# Altium project miaow-foc-board.prjpcb (part 1 of 2)
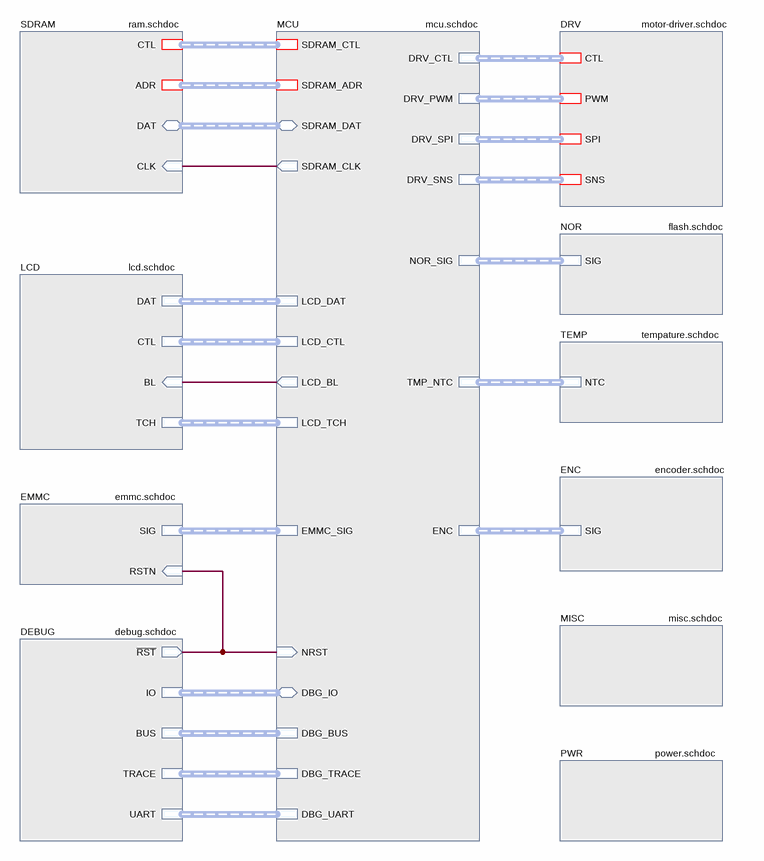
[diagram p0: top.schdoc]
Board: MIAOW FOC BOARD; Url: github.com/miaow-cn/foc-hw; Sample: A1; Liscense: GPLv3
14 sheets, 437 parts. Net scope: hierarchical (ports join the sheet entries above them; power ports are global).
Board file: miaow-foc-board.pcbdoc
Sheets:
  top.schdoc
    DRV = motor-driver.schdoc
    SDRAM = ram.schdoc
    PWR = power.schdoc
    MCU = mcu.schdoc
      MCU_PWR = mcu-power.schdoc
      MCU_SIG = mcu-io.schdoc
    LCD = lcd.schdoc
    EMMC = emmc.schdoc
    NOR = flash.schdoc
    DEBUG = debug.schdoc
    TEMP = tempature.schdoc
    MISC = misc.schdoc
    ENC = encoder.schdoc

## Sheet top.schdoc: TOP
size A4; Date: 10.25.2025; CheckedBy: BCY; DrawnBy: miaow; DocumentNumber: 1; Revision: v1.0.0; SheetNumber: 1; SheetTotal: 14; BoardType: MAIN_PCB; Desc: Top block diagram

### Sub-sheets
DEBUG = debug.schdoc: BUS (harness DBG_BUS), ~{RST} (out), TRACE (harness DBG_TRACE), UART (harness DBG_UART), IO (harness DBG_IO)
DRV = motor-driver.schdoc: CTL (harness DRV_CTL), SNS (harness DRV_SNS), SPI (harness DRV_SPI), PWM (harness DRV_PWM)
EMMC = emmc.schdoc: SIG (harness EMMC_SIG), RSTN (in)
ENC = encoder.schdoc: SIG (harness ENC_SIG)
LCD = lcd.schdoc: DAT (harness LCD_DAT), CTL (harness LCD_CTL), BL (in), TCH (harness LCD_TCH)
MCU = mcu.schdoc: SDRAM_CLK (out), SDRAM_CTL (harness SDRAM_CTL), SDRAM_ADR (harness SDRAM_ADR), SDRAM_DAT (bidir, harness SDRAM_DAT), DRV_CTL (harness DRV_CTL), DRV_PWM (harness DRV_PWM), DRV_SPI (harness DRV_SPI), DRV_SNS (harness DRV_SNS), NRST (in), LCD_DAT (harness LCD_DAT), LCD_BL (out), LCD_TCH (harness LCD_TCH), EMMC_SIG (harness EMMC_SIG), NOR_SIG (harness NOR_SIG), LCD_CTL (harness LCD_CTL), DBG_TRACE (harness DBG_TRACE), DBG_UART (harness DBG_UART), DBG_BUS (harness DBG_BUS), DBG_IO (bidir, harness DBG_IO), TMP_NTC (harness TMP_NTC), ENC (harness ENC_SIG)
MISC = misc.schdoc: no entries
NOR = flash.schdoc: SIG (harness NOR_SIG)
PWR = power.schdoc: no entries
SDRAM = ram.schdoc: ADR (harness SDRAM_ADR), CTL (harness SDRAM_CTL), CLK (in), DAT (bidir, harness SDRAM_DAT)
TEMP = tempature.schdoc: NTC (harness TMP_NTC)

### Nets
BL: sheet MCU/LCD_BL, sheet LCD/BL
NRST: sheet MCU/NRST, sheet EMMC/RSTN, sheet DEBUG/~{RST}
SDRAM_CLK: sheet SDRAM/CLK, sheet MCU/SDRAM_CLK

### Buses and harness runs
harness sheet DEBUG/BUS = sheet MCU/DBG_BUS
harness sheet DEBUG/IO = sheet MCU/DBG_IO
harness sheet DEBUG/TRACE = sheet MCU/DBG_TRACE
harness sheet DEBUG/UART = sheet MCU/DBG_UART
harness sheet DRV/CTL = sheet MCU/DRV_CTL
harness sheet DRV/PWM = sheet MCU/DRV_PWM
harness sheet DRV/SNS = sheet MCU/DRV_SNS
harness sheet DRV/SPI = sheet MCU/DRV_SPI
harness sheet EMMC/SIG = sheet MCU/EMMC_SIG
harness sheet ENC/SIG = sheet MCU/ENC
harness sheet LCD/CTL = sheet MCU/LCD_CTL
harness sheet LCD/DAT = sheet MCU/LCD_DAT
harness sheet LCD/TCH = sheet MCU/LCD_TCH
harness sheet MCU/NOR_SIG = sheet NOR/SIG
harness sheet MCU/SDRAM_ADR = sheet SDRAM/ADR
harness sheet MCU/SDRAM_CTL = sheet SDRAM/CTL
harness sheet MCU/SDRAM_DAT = sheet SDRAM/DAT
harness sheet MCU/TMP_NTC = sheet TEMP/NTC

### Notes on the sheet
- DRAWN
- CHECKED
- DRAWNBY
- SHEETS
- SHEETS_NO

## Sheet motor-driver.schdoc: DRV
size A4; Date: 10.25.2025; CheckedBy: BCY; DrawnBy: miaow; DocumentNumber: 9; Revision: v1.0.0; SheetNumber: 9; SheetTotal: 14; BoardType: MAIN_PCB; Desc: PMSM & BLDC driver
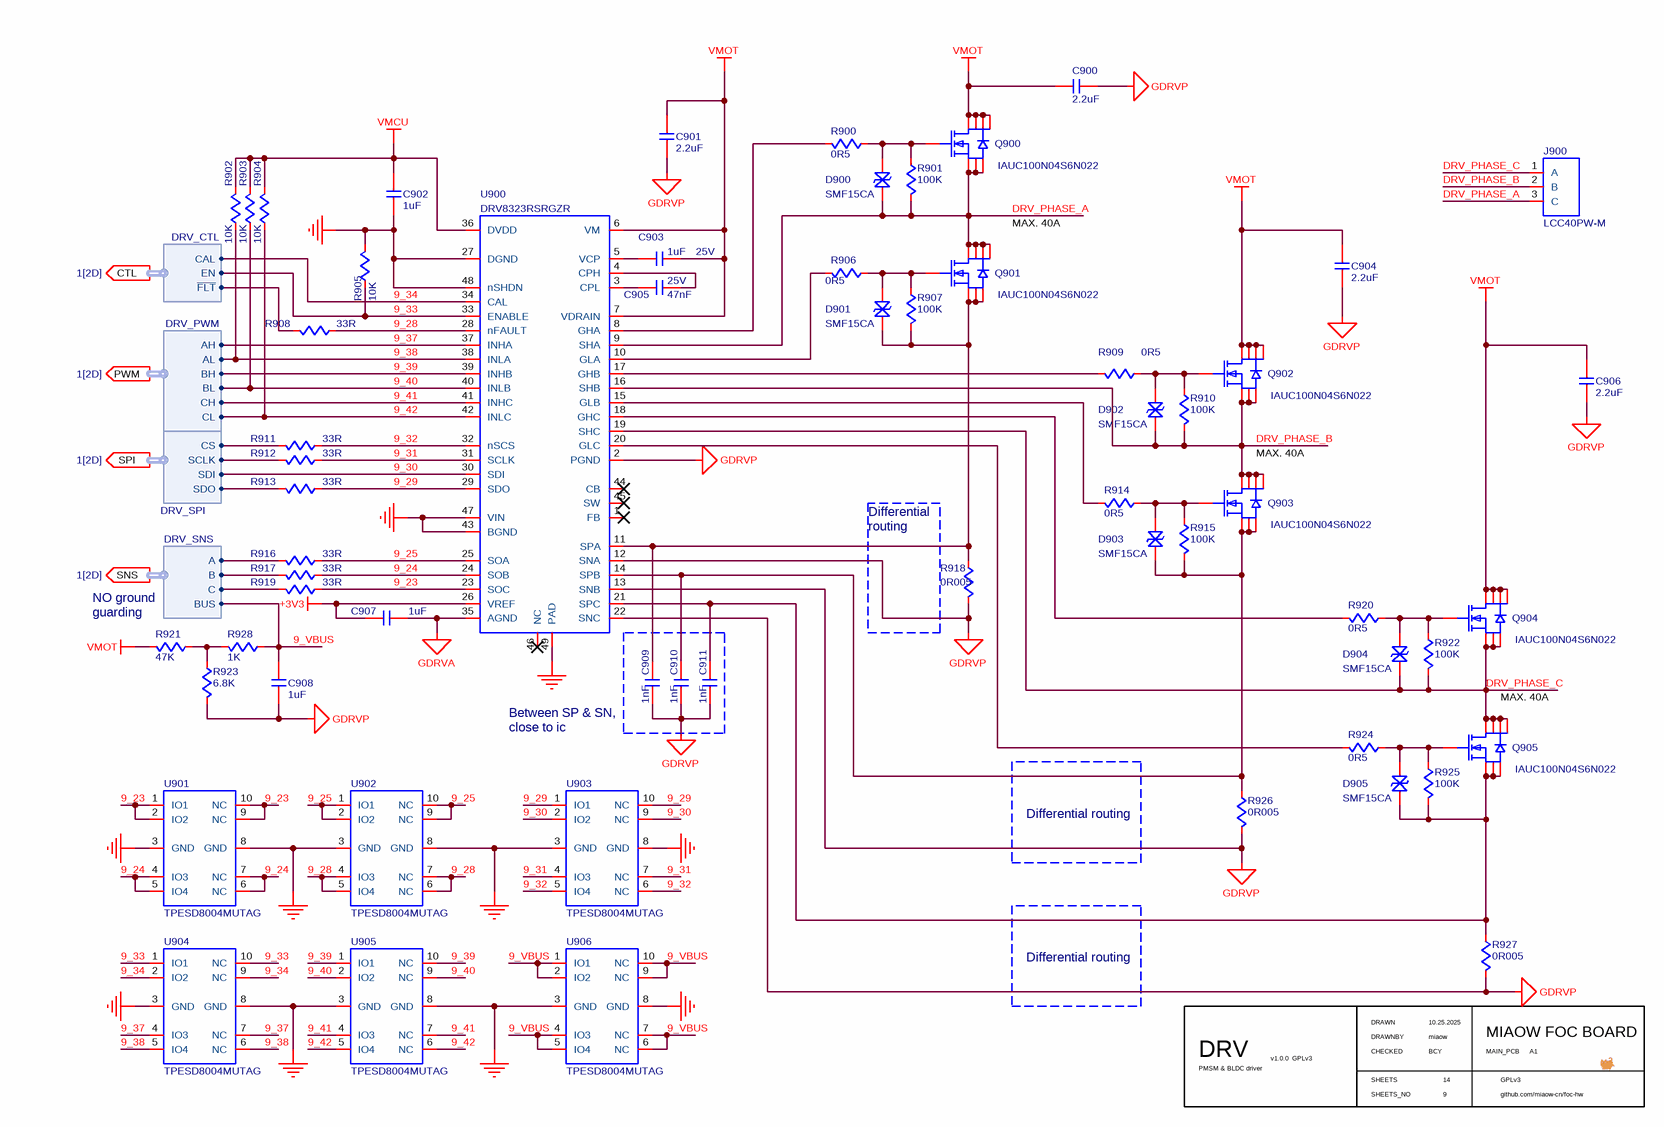
[diagram p1: motor-driver.schdoc]

### Parts
C900  value 2.2uF  [C0603]  (hidden comment: C-NOMO)
C901  value 2.2uF  [C0603]  (hidden comment: C-NOMO)
C902  value 1uF  [C0402]  (hidden comment: C-NOMO)
C903  value 1uF  voltage: 25V  [C0402]  (hidden comment: C-NOMO)
C904  value 2.2uF  [C0603]  (hidden comment: C-NOMO)
C905  value 47nF  voltage: 25V  [C0402]  (hidden comment: C-NOMO)
C906  value 2.2uF  [C0603]  (hidden comment: C-NOMO)
C907  value 1uF  [C0402]  (hidden comment: C-NOMO)
C908  value 1uF  [C0603]  (hidden comment: C-NOMO)
C909  value 1nF  [C0402]  (hidden comment: C-NOMO)
C910  value 1nF  [C0402]  (hidden comment: C-NOMO)
C911  value 1nF  [C0402]  (hidden comment: C-NOMO)
D900  SMF15CA  [SMF15CA]
D901  SMF15CA  [SMF15CA]
D902  SMF15CA  [SMF15CA]
D903  SMF15CA  [SMF15CA]
D904  SMF15CA  [SMF15CA]
D905  SMF15CA  [SMF15CA]
J900  LCC40PW-M  [LCC40PW-M]
Q900  IAUC100N04S6N022  [IAUC100N04S6N022]
Q901  IAUC100N04S6N022  [IAUC100N04S6N022]
Q902  IAUC100N04S6N022  [IAUC100N04S6N022]
Q903  IAUC100N04S6N022  [IAUC100N04S6N022]
Q904  IAUC100N04S6N022  [IAUC100N04S6N022]
Q905  IAUC100N04S6N022  [IAUC100N04S6N022]
R900  value 0R5  [R0402]  (hidden comment: R)
R901  value 100K  [R0603]  (hidden comment: R)
R902  value 10K  [R0402]  (hidden comment: R)
R903  value 10K  [R0402]  (hidden comment: R)
R904  value 10K  [R0402]  (hidden comment: R)
R905  value 10K  [R0402]  (hidden comment: R)
R906  value 0R5  [R0402]  (hidden comment: R)
R907  value 100K  [R0603]  (hidden comment: R)
R908  value 33R  [R0402]  (hidden comment: R)
R909  value 0R5  [R0402]  (hidden comment: R)
R910  value 100K  [R0603]  (hidden comment: R)
R911  value 33R  [R0402]  (hidden comment: R)
R912  value 33R  [R0402]  (hidden comment: R)
R913  value 33R  [R0402]  (hidden comment: R)
R914  value 0R5  [R0402]  (hidden comment: R)
R915  value 100K  [R0603]  (hidden comment: R)
R916  value 33R  [R0402]  (hidden comment: R)
R917  value 33R  [R0402]  (hidden comment: R)
R918  value 0R005  [R2512]  (hidden comment: R)
R919  value 33R  [R0402]  (hidden comment: R)
R920  value 0R5  [R0402]  (hidden comment: R)
R921  value 47K  [R0603]  (hidden comment: R)
R922  value 100K  [R0603]  (hidden comment: R)
R923  value 6.8K  [R0603]  (hidden comment: R)
R924  value 0R5  [R0402]  (hidden comment: R)
R925  value 100K  [R0603]  (hidden comment: R)
R926  value 0R005  [R2512]  (hidden comment: R)
R927  value 0R005  [R2512]  (hidden comment: R)
R928  value 1K  [R0603]  (hidden comment: R)
U900  DRV8323RSRGZR  [DRV8323RSRGZR]
U901  TPESD8004MUTAG  [TPESD8004MUTAG]
U902  TPESD8004MUTAG  [TPESD8004MUTAG]
U903  TPESD8004MUTAG  [TPESD8004MUTAG]
U904  TPESD8004MUTAG  [TPESD8004MUTAG]
U905  TPESD8004MUTAG  [TPESD8004MUTAG]
U906  TPESD8004MUTAG  [TPESD8004MUTAG]

### Ports
CTL (out, harness DRV_CTL, see 1[2D]), PWM (out, harness DRV_PWM, see 1[2D]), SNS (out, harness DRV_SNS, see 1[2D]), SPI (out, harness DRV_SPI, see 1[2D])

### Harnesses
DRV_CTL: CAL, EN, ~{FLT}
DRV_SNS: C, B, A, BUS
DRV_SPI: CS, SCLK, SDI, SDO
DRV_PWM: AH, AL, BH, BL, CH, CL

### Nets
+3V3: C902.2 C907.1 R902.1 R903.1 R904.1 U900.26(VREF) U900.36(DVDD)  [also labelled VMCU]
GDRVA: C902.1 C907.2 R905.1 U900.27(DGND) U900.35(AGND) U900.43(BGND) U900.47(VIN) U900.48(nSHDN) U900.49(PAD) U901.3(GND) U901.8(GND) U902.3(GND) U902.8(GND) U903.3(GND) U903.8(GND) U904.3(GND) U904.8(GND) U905.3(GND) U905.8(GND) U906.3(GND) U906.8(GND)  [also labelled GND]
GDRVP: C900.1 C901.1 C904.1 C906.1 C908.2 C909.1 C910.1 C911.1 R918.1 R923.1 R926.1 R927.1 U900.2(PGND) U900.12(SNA) U900.13(SNB) U900.22(SNC)
VMOT: C900.2 C901.2 C903.2 C904.2 C906.2 Q900.5(D) Q900.6(D) Q900.7(D) Q900.8(D) Q902.5(D) Q902.6(D) Q902.7(D) Q902.8(D) Q904.5(D) Q904.6(D) Q904.7(D) Q904.8(D) R921.1 U900.6(VM) U900.7(VDRAIN)
9_23: R919.2 U900.23(SOC) U901.1(IO1) U901.2(IO2) U901.9(NC) U901.10(NC)
9_24: R917.2 U900.24(SOB) U901.4(IO3) U901.5(IO4) U901.6(NC) U901.7(NC)
9_25: R916.2 U900.25(SOA) U902.1(IO1) U902.2(IO2) U902.9(NC) U902.10(NC)
9_28: R908.2 U900.28(nFAULT) U902.4(IO3) U902.5(IO4) U902.6(NC) U902.7(NC)
9_29: R913.2 U900.29(SDO) U903.1(IO1) U903.10(NC)
9_30: U900.30(SDI) U903.2(IO2) U903.9(NC) ; port SPI.SDI
9_31: R912.2 U900.31(SCLK) U903.4(IO3) U903.7(NC)
9_32: R911.2 U900.32(nSCS) U903.5(IO4) U903.6(NC)
9_33: R905.2 U900.33(ENABLE) U904.1(IO1) U904.10(NC) ; port CTL.EN
9_34: U900.34(CAL) U904.2(IO2) U904.9(NC) ; port CTL.CAL
9_37: U900.37(INHA) U904.4(IO3) U904.7(NC) ; port PWM.AH
9_38: R902.2 U900.38(INLA) U904.5(IO4) U904.6(NC) ; port PWM.AL
9_39: U900.39(INHB) U905.1(IO1) U905.10(NC) ; port PWM.BH
9_40: R903.2 U900.40(INLB) U905.2(IO2) U905.9(NC) ; port PWM.BL
9_41: U900.41(INHC) U905.4(IO3) U905.7(NC) ; port PWM.CH
9_42: R904.2 U900.42(INLC) U905.5(IO4) U905.6(NC) ; port PWM.CL
9_VBUS: C908.1 R928.2 U906.1(IO1) U906.2(IO2) U906.4(IO3) U906.5(IO4) U906.6(NC) U906.7(NC) U906.9(NC) U906.10(NC) ; port SNS.BUS
DRV_CS: R911.1 ; port SPI.CS
DRV_FLT: R908.1 ; port CTL.~{FLT}
DRV_PHASE_A: D900.1 J900.3(C) Q900.1(S) Q900.2(S) Q900.3(S) Q901.5(D) Q901.6(D) Q901.7(D) Q901.8(D) R901.1 U900.9(SHA)
DRV_PHASE_B: D902.1 J900.2(B) Q902.1(S) Q902.2(S) Q902.3(S) Q903.5(D) Q903.6(D) Q903.7(D) Q903.8(D) R910.1 U900.16(SHB)
DRV_PHASE_C: D904.1 J900.1(A) Q904.1(S) Q904.2(S) Q904.3(S) Q905.5(D) Q905.6(D) Q905.7(D) Q905.8(D) R922.1 U900.19(SHC)
DRV_SCLK: R912.1 ; port SPI.SCLK
DRV_SDO: R913.1 ; port SPI.SDO
DRV_SNS_A: R916.1 ; port SNS.A
DRV_SNS_B: R917.1 ; port SNS.B
DRV_SNS_C: R919.1 ; port SNS.C
NetC903_1: C903.1 U900.5(VCP)
NetC905_1: C905.1 U900.3(CPL)
NetC905_2: C905.2 U900.4(CPH)
NetC909_2: C909.2 D901.1 Q901.1(S) Q901.2(S) Q901.3(S) R907.1 R918.2 U900.11(SPA)
NetC910_2: C910.2 D903.1 Q903.1(S) Q903.2(S) Q903.3(S) R915.1 R926.2 U900.14(SPB)
NetC911_2: C911.2 D905.1 Q905.1(S) Q905.2(S) Q905.3(S) R925.1 R927.2 U900.21(SPC)
NetD900_2: D900.2 Q900.4(G) R900.2 R901.2
NetD901_2: D901.2 Q901.4(G) R906.2 R907.2
NetD902_2: D902.2 Q902.4(G) R909.2 R910.2
NetD903_2: D903.2 Q903.4(G) R914.2 R915.2
NetD904_2: D904.2 Q904.4(G) R920.2 R922.2
NetD905_2: D905.2 Q905.4(G) R924.2 R925.2
NetR900_1: R900.1 U900.8(GHA)
NetR906_1: R906.1 U900.10(GLA)
NetR909_1: R909.1 U900.17(GHB)
NetR914_1: R914.1 U900.15(GLB)
NetR920_1: R920.1 U900.18(GHC)
NetR921_2: R921.2 R923.2 R928.1
NetR924_1: R924.1 U900.20(GLC)

Not connected (* = marked no-connect by the designer): U900 1(FB)* 44(CB)* 45(SW)* 46(NC)*

### Notes on the sheet
- (near Q901) MAX. 40A
- (near Q903) MAX. 40A
- (near R918) Differential routing
- (near R921) NO ground guarding
- (near Q905) MAX. 40A
- (near C909) Between SP & SN, close to ic
- Differential routing
- DRAWN
- CHECKED
- DRAWNBY
- SHEETS
- SHEETS_NO

### Library data of the parts
C900-C902 C904 C906-C911 = C-NOMO: voltage: 25V; precision: 5%
C903 C905 = C-NOMO: precision: 5%
D900-D905 = SMF15CA: TVS/ESD; Supplier 1: LCSC; Supplier Part Number 1: C123803
J900 = LCC40PW-M: CONNECTOR - 3pin, power; Supplier 1: LCSC; Supplier Part Number 1: C7437310
R900-R928 = R: precision: 1%
U901-U906 = TPESD8004MUTAG: TVS/ESD; Supplier 1: LCSC; Supplier Part Number 1: C2827679
Q900-Q905 = IAUC100N04S6N022: Supplier 1: LCSC; Supplier Part Number 1: C535695
U900 = DRV8323RSRGZR: Supplier 1: LCSC; Supplier Part Number 1: C545497

## Sheet ram.schdoc: RAM
size A4; Date: 10.25.2025; CheckedBy: BCY; DrawnBy: miaow; DocumentNumber: 3; Revision: v1.0.0; SheetNumber: 3; SheetTotal: 14; BoardType: MAIN_PCB; Desc: SDRAM for mcu
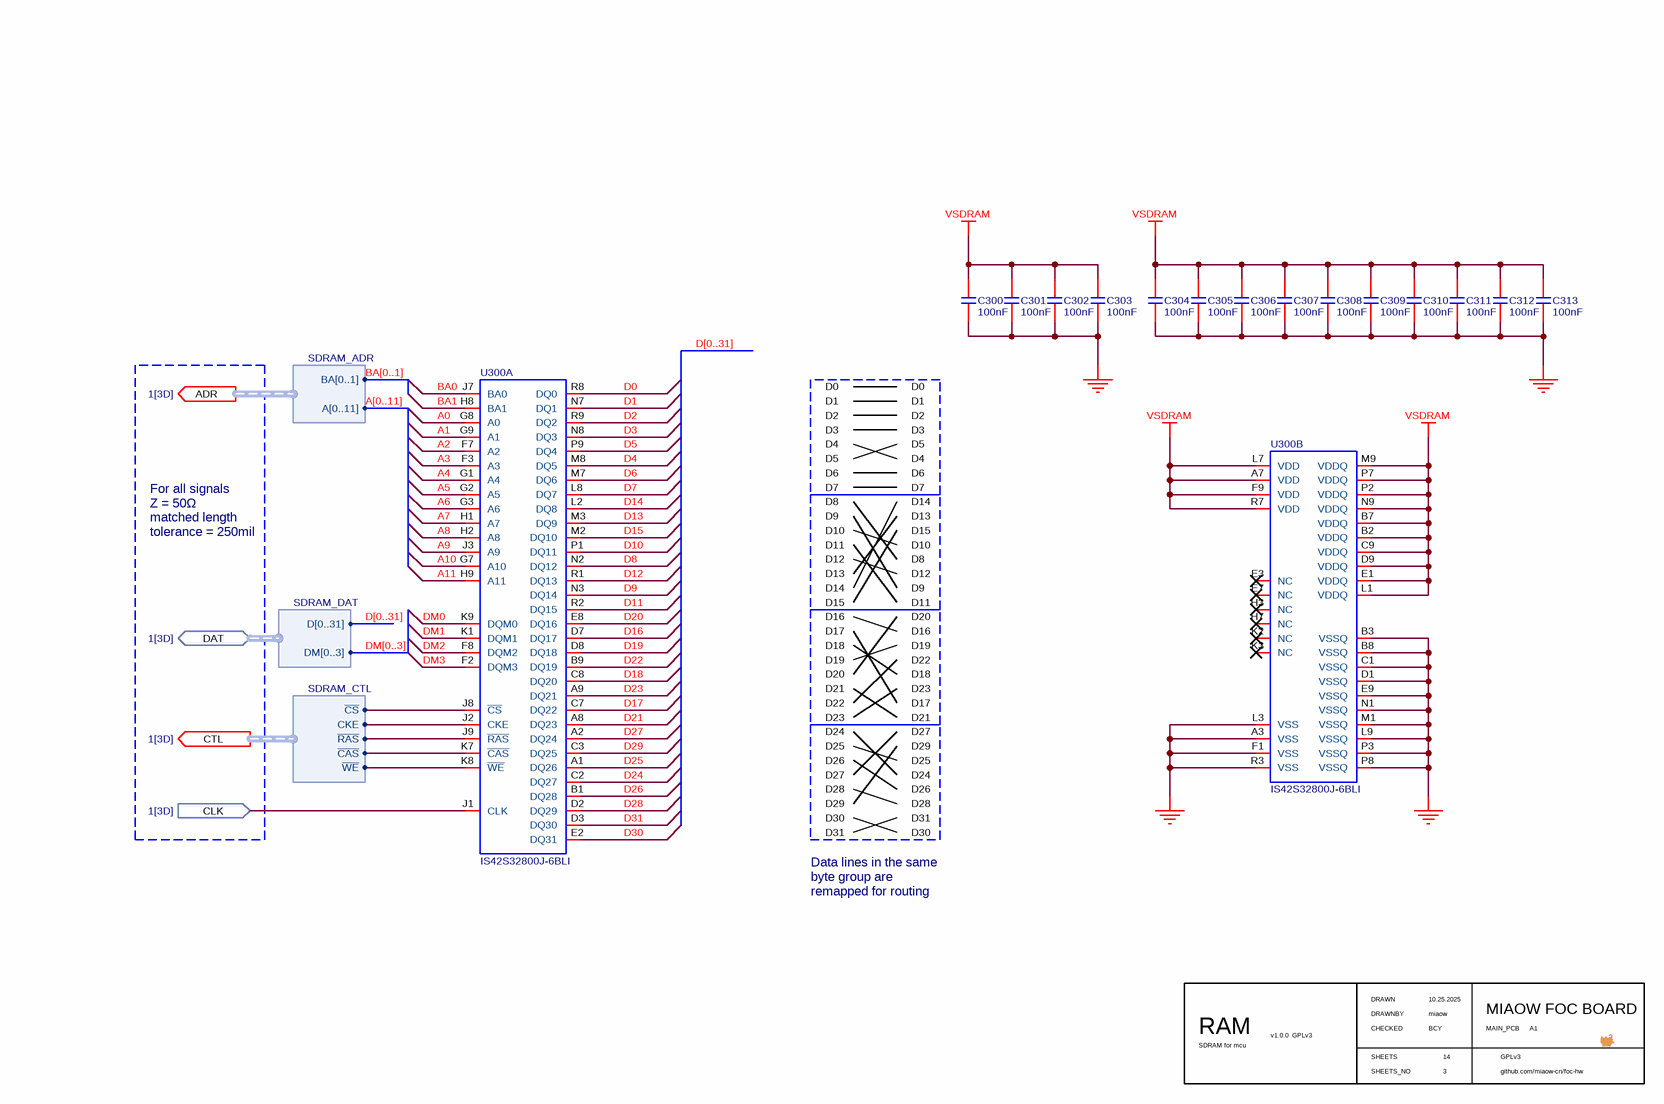
[diagram p2: ram.schdoc]

### Parts
C300  value 100nF  [C0402]  (hidden comment: C-NOMO)
C301  value 100nF  [C0402]  (hidden comment: C-NOMO)
C302  value 100nF  [C0402]  (hidden comment: C-NOMO)
C303  value 100nF  [C0402]  (hidden comment: C-NOMO)
C304  value 100nF  [C0402]  (hidden comment: C-NOMO)
C305  value 100nF  [C0402]  (hidden comment: C-NOMO)
C306  value 100nF  [C0402]  (hidden comment: C-NOMO)
C307  value 100nF  [C0402]  (hidden comment: C-NOMO)
C308  value 100nF  [C0402]  (hidden comment: C-NOMO)
C309  value 100nF  [C0402]  (hidden comment: C-NOMO)
C310  value 100nF  [C0402]  (hidden comment: C-NOMO)
C311  value 100nF  [C0402]  (hidden comment: C-NOMO)
C312  value 100nF  [C0402]  (hidden comment: C-NOMO)
C313  value 100nF  [C0402]  (hidden comment: C-NOMO)
U300  IS42S32800J-6BLI  [IS42S32800J-6BLI]  (parts A,B of 2)

### Ports
ADR (out, harness SDRAM_ADR, see 1[3D]), CLK (in, see 1[3D]), CTL (out, harness SDRAM_CTL, see 1[3D]), DAT (bidir, harness SDRAM_DAT, see 1[3D])

### Harnesses
SDRAM_CTL: ~{CS}, CKE, ~{RAS}, ~{CAS}, ~{WE}
SDRAM_ADR: BA[0..1], A[0..11]
SDRAM_DAT: DM[0..3], D[0..31]

### Nets
GND: C300.1 C301.1 C302.1 C303.1 C304.1 C305.1 C306.1 C307.1 C308.1 C309.1 C310.1 C311.1 C312.1 C313.1 U300.A3(VSS) U300.B3(VSSQ) U300.B8(VSSQ) U300.C1(VSSQ) U300.D1(VSSQ) U300.E9(VSSQ) U300.F1(VSS) U300.L3(VSS) U300.L9(VSSQ) U300.M1(VSSQ) U300.N1(VSSQ) U300.P3(VSSQ) U300.P8(VSSQ) U300.R3(VSS)  [project net GDRVA]
VSDRAM: C300.2 C301.2 C302.2 C303.2 C304.2 C305.2 C306.2 C307.2 C308.2 C309.2 C310.2 C311.2 C312.2 C313.2 U300.A7(VDD) U300.B2(VDDQ) U300.B7(VDDQ) U300.C9(VDDQ) U300.D9(VDDQ) U300.E1(VDDQ) U300.F9(VDD) U300.L1(VDDQ) U300.L7(VDD) U300.M9(VDDQ) U300.N9(VDDQ) U300.P2(VDDQ) U300.P7(VDDQ) U300.R7(VDD)  [project net +3V3]
A0: U300.G8(A0)
A1: U300.G9(A1)
A2: U300.F7(A2)
A3: U300.F3(A3)
A4: U300.G1(A4)
A5: U300.G2(A5)
A6: U300.G3(A6)
A7: U300.H1(A7)
A8: U300.H2(A8)
A9: U300.J3(A9)
A10: U300.G7(A10)
A11: U300.H9(A11)
BA0: U300.J7(BA0)
BA1: U300.H8(BA1)
D0: U300.R8(DQ0)
D1: U300.N7(DQ1)
D2: U300.R9(DQ2)
D3: U300.N8(DQ3)
D4: U300.M8(DQ5)
D5: U300.P9(DQ4)
D6: U300.M7(DQ6)
D7: U300.L8(DQ7)
D8: U300.N2(DQ12)
D9: U300.N3(DQ14)
D10: U300.P1(DQ11)
D11: U300.R2(DQ15)
D12: U300.R1(DQ13)
D13: U300.M3(DQ9)
D14: U300.L2(DQ8)
D15: U300.M2(DQ10)
D16: U300.D7(DQ17)
D17: U300.C7(DQ22)
D18: U300.C8(DQ20)
D19: U300.D8(DQ18)
D20: U300.E8(DQ16)
D21: U300.A8(DQ23)
D22: U300.B9(DQ19)
D23: U300.A9(DQ21)
D24: U300.C2(DQ27)
D25: U300.A1(DQ26)
D26: U300.B1(DQ28)
D27: U300.A2(DQ24)
D28: U300.D2(DQ29)
D29: U300.C3(DQ25)
D30: U300.E2(DQ31)
D31: U300.D3(DQ30)
DM0: U300.K9(DQM0)
DM1: U300.K1(DQM1)
DM2: U300.F8(DQM2)
DM3: U300.F2(DQM3)
SDRAM_CAS: U300.K7(~{CAS}) ; port CTL.~{CAS}
SDRAM_CKE: U300.J2(CKE) ; port CTL.CKE
SDRAM_CLK: U300.J1(CLK) ; port CLK
SDRAM_CS: U300.J8(~{CS}) ; port CTL.~{CS}
SDRAM_RAS: U300.J9(~{RAS}) ; port CTL.~{RAS}
SDRAM_WE: U300.K8(~{WE}) ; port CTL.~{WE}

Not connected (* = marked no-connect by the designer): U300 E3(NC)* E7(NC)* H3(NC)* H7(NC)* K2(NC)* K3(NC)*

### Buses and harness runs
bus A[0..11]
bus BA[0..1]
bus D[0..31]
bus DM[0..3]

### Notes on the sheet
- D0
- D1
- D2
- D3
- D4
- D5
- D6
- D7
- D8
- D9
- D10
- D11
- D14
- D15
- D13
- For all signals
  Z = 50Ω
  matched length tolerance = 250mil
- D12
- D16
- D20
- D17
- D18
- D19
- D21
- D23
- D22
- D24
- D25
- D26
- D27
- D29
- D28
- D30
- D31
- Data lines in the same byte group are remapped for routing
- DRAWN
- CHECKED
- DRAWNBY
- SHEETS
- SHEETS_NO

### Library data of the parts
C300-C313 = C-NOMO: voltage: 25V; precision: 5%
U300 = IS42S32800J-6BLI: Supplier 1: LCSC; Supplier Part Number 1: C1351419

## Sheet power.schdoc: PWR
size A4; Date: 10.25.2025; CheckedBy: BCY; DrawnBy: miaow; DocumentNumber: 2; Revision: v1.0.0; SheetNumber: 2; SheetTotal: 14; BoardType: MAIN_PCB; Desc: Power filter and rails
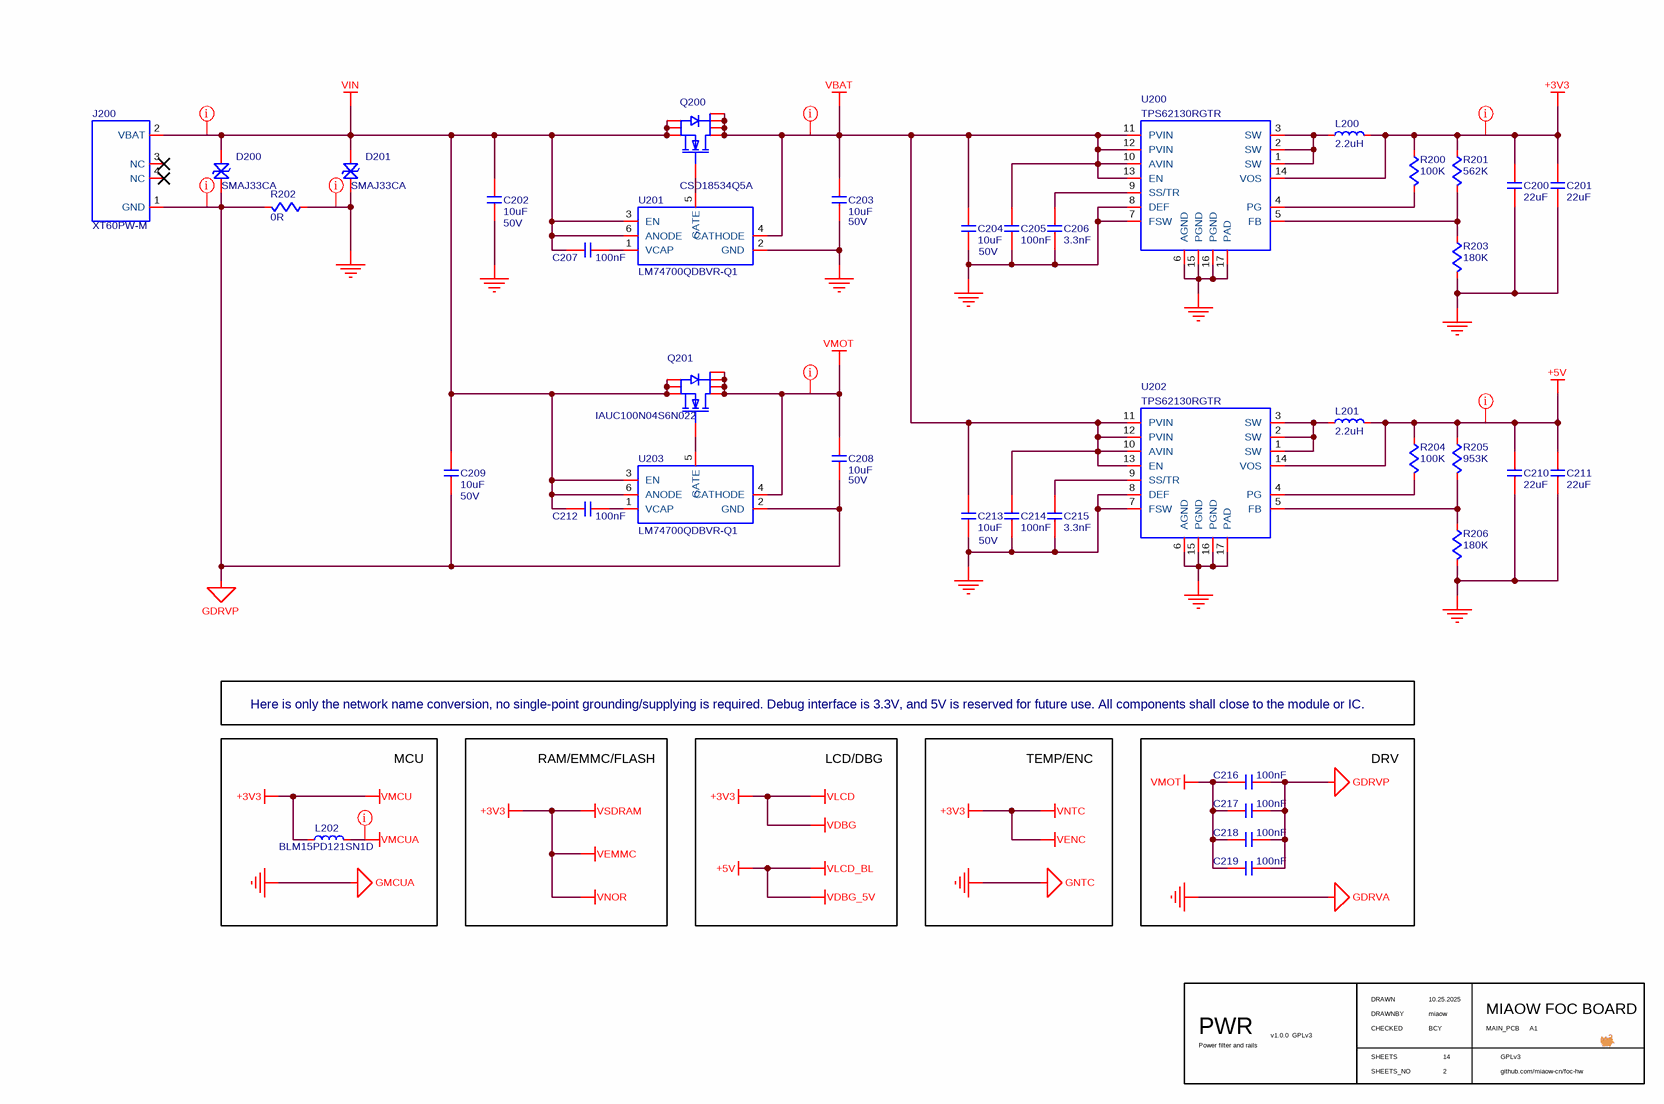
[diagram p3: power.schdoc]

### Parts
C200  value 22uF  [C0805]  (hidden comment: C-NOMO)
C201  value 22uF  [C0805]  (hidden comment: C-NOMO)
C202  value 10uF  voltage: 50V  [C0805]  (hidden comment: C-NOMO)
C203  value 10uF  voltage: 50V  [C0805]  (hidden comment: C-NOMO)
C204  value 10uF  voltage: 50V  [C0805]  (hidden comment: C-NOMO)
C205  value 100nF  [C0603]  (hidden comment: C-NOMO)
C206  value 3.3nF  [C0402]  (hidden comment: C-NOMO)
C207  value 100nF  [C0402]  (hidden comment: C-NOMO)
C208  value 10uF  voltage: 50V  [C0805]  (hidden comment: C-NOMO)
C209  value 10uF  voltage: 50V  [C0805]  (hidden comment: C-NOMO)
C210  value 22uF  [C0805]  (hidden comment: C-NOMO)
C211  value 22uF  [C0805]  (hidden comment: C-NOMO)
C212  value 100nF  [C0402]  (hidden comment: C-NOMO)
C213  value 10uF  voltage: 50V  [C0805]  (hidden comment: C-NOMO)
C214  value 100nF  [C0603]  (hidden comment: C-NOMO)
C215  value 3.3nF  [C0402]  (hidden comment: C-NOMO)
C216  value 100nF  [C0603]  (hidden comment: C-NOMO)
C217  value 100nF  [C0603]  (hidden comment: C-NOMO)
C218  value 100nF  [C0603]  (hidden comment: C-NOMO)
C219  value 100nF  [C0603]  (hidden comment: C-NOMO)
D200  SMAJ33CA  [SMAJ33CA]
D201  SMAJ33CA  [SMAJ33CA]
J200  XT60PW-M  [XT60PW-M]
L200  value 2.2uH  [FXL0420]  (hidden comment: L)
L201  value 2.2uH  [FXL0420]  (hidden comment: L)
L202  BLM15PD121SN1D  [L0402]
Q200  CSD18534Q5A  [CSD18534Q5A]
Q201  IAUC100N04S6N022  [IAUC100N04S6N022]
R200  value 100K  [R0402]  (hidden comment: R)
R201  value 562K  [R0603]  (hidden comment: R)
R202  value 0R  [R1206]  (hidden comment: R)
R203  value 180K  [R0603]  (hidden comment: R)
R204  value 100K  [R0402]  (hidden comment: R)
R205  value 953K  [R0603]  (hidden comment: R)
R206  value 180K  [R0603]  (hidden comment: R)
U200  TPS62130RGTR  [TPS62130RGTR]
U201  LM74700QDBVR-Q1  [LM74700QDBVR-Q1]
U202  TPS62130RGTR  [TPS62130RGTR]
U203  LM74700QDBVR-Q1  [LM74700QDBVR-Q1]

### Blocks framed on the sheet
MCU: L202
DRV: C216-C219

### Nets
+3V3: C200.2 C201.2 L200.2 L202.1 R200.2 R201.2 U200.14(VOS)  [also labelled VDBG, VEMMC, VENC, VLCD, VMCU, VNOR, VNTC, VSDRAM]
+5V: C210.2 C211.2 L201.2 R204.2 R205.2 U202.14(VOS)  [also labelled VDBG_5V, VLCD_BL]
GDRVA: C200.1 C201.1 C202.1 C203.1 C204.1 C205.1 C206.1 C210.1 C211.1 C213.1 C214.1 C215.1 D201.1 R202.2 R203.1 R206.1 U200.6(AGND) U200.7(FSW) U200.8(DEF) U200.15(PGND) U200.16(PGND) U200.17(PAD) U201.2(GND) U202.6(AGND) U202.7(FSW) U202.8(DEF) U202.15(PGND) U202.16(PGND) U202.17(PAD)  [also labelled GMCUA, GND, GNTC]
GDRVP: C208.1 C209.1 C216.1 C217.1 C218.1 C219.1 D200.1 J200.1(GND) R202.1 U203.2(GND)
VBAT: C203.2 C204.2 C205.2 C213.2 C214.2 Q200.5(D) Q200.6(D) Q200.7(D) Q200.8(D) U200.10(AVIN) U200.11(PVIN) U200.12(PVIN) U200.13(EN) U201.4(CATHODE) U202.10(AVIN) U202.11(PVIN) U202.12(PVIN) U202.13(EN)
VIN: C202.2 C207.1 C209.2 C212.1 D200.2 D201.2 J200.2(VBAT) Q200.1(S) Q200.2(S) Q200.3(S) Q201.1(S) Q201.2(S) Q201.3(S) U201.3(EN) U201.6(ANODE) U203.3(EN) U203.6(ANODE)
VMCUA: L202.2
VMOT: C208.2 C216.2 C217.2 C218.2 C219.2 Q201.5(D) Q201.6(D) Q201.7(D) Q201.8(D) U203.4(CATHODE)
NetC206_2: C206.2 U200.9(SS/TR)
NetC207_2: C207.2 U201.1(VCAP)
NetC212_2: C212.2 U203.1(VCAP)
NetC215_2: C215.2 U202.9(SS/TR)
NetL200_1: L200.1 U200.1(SW) U200.2(SW) U200.3(SW)
NetL201_1: L201.1 U202.1(SW) U202.2(SW) U202.3(SW)
NetQ200_4: Q200.4(G) U201.5(GATE)
NetQ201_4: Q201.4(G) U203.5(GATE)
NetR200_1: R200.1 U200.4(PG)
NetR201_1: R201.1 R203.2 U200.5(FB)
NetR204_1: R204.1 U202.4(PG)
NetR205_1: R205.1 R206.2 U202.5(FB)

Not connected (* = marked no-connect by the designer): J200 3(NC)* 4(NC)*

### Layout directives
net class CLS_PWR; rule Supply Nets [Voltage = 12.00]: VIN
net class CLS_PWR: +3V3, +5V, VBAT, VMCUA, VMOT
net class CLS_GND: GDRVA, GDRVP

### Notes on the sheet
- Here is only the network name conversion, no single-point grounding/supplying is required. Debug interface is 3.3V, and 5V is reserved for future use. All components shall close to the module or IC.
- RAM/EMMC/FLASH
- LCD/DBG
- TEMP/ENC
- DRAWN
- CHECKED
- DRAWNBY
- SHEETS
- SHEETS_NO

### Library data of the parts
C200 C201 C205-C207 C210-C212 C214-C219 = C-NOMO: voltage: 25V; precision: 5%
C202-C204 C208 C209 C213 = C-NOMO: precision: 5%
D200 D201 = SMAJ33CA: TVS/ESD; Supplier 1: LCSC; Supplier Part Number 1: C316048
J200 = XT60PW-M: CONNECTOR - dc supply; Supplier 1: LCSC; Supplier Part Number 1: C98732
L200 L201 = L: Code_IEC: 1005; Published: 8-Jun-2000; LatestRevisionDate: 29-May-2009; LatestRevisionNote: IPC-7351 Footprint Added.; PackageReference: 0402-A; Publisher: Altium Limited; PackageDescription: Chip Inductor; Code_JEITA: 0402
L202 = L: Code_IEC: 1005; Value: 120R@100MHz; Published: 8-Jun-2000; LatestRevisionDate: 29-May-2009; LatestRevisionNote: IPC-7351 Footprint Added.; PackageReference: 0402-A; Publisher: Altium Limited; PackageDescription: Chip Inductor; Code_JEITA: 0402
Q200 = CSD18534Q5A: NMOS; Supplier 1: LCSC; Supplier Part Number 1: C115943
Q201 = IAUC100N04S6N022: NMOS; Supplier 1: LCSC; Supplier Part Number 1: C535695
R200-R206 = R: precision: 1%
U201 U203 = LM74700QDBVR-Q1: IDEAL DIODE; Supplier Part Number 1: C2941042; Supplier 1: LCSC
U200 U202 = TPS62130RGTR: Supplier 1: LCSC; Supplier Part Number 1: C43590

## Sheet mcu.schdoc: MCU
size A4; Date: 10.25.2025; CheckedBy: BCY; DrawnBy: miaow; DocumentNumber: 11; Revision: v1.0.0; SheetNumber: 11; SheetTotal: 14; BoardType: MAIN_PCB; Desc: MCB block diagram
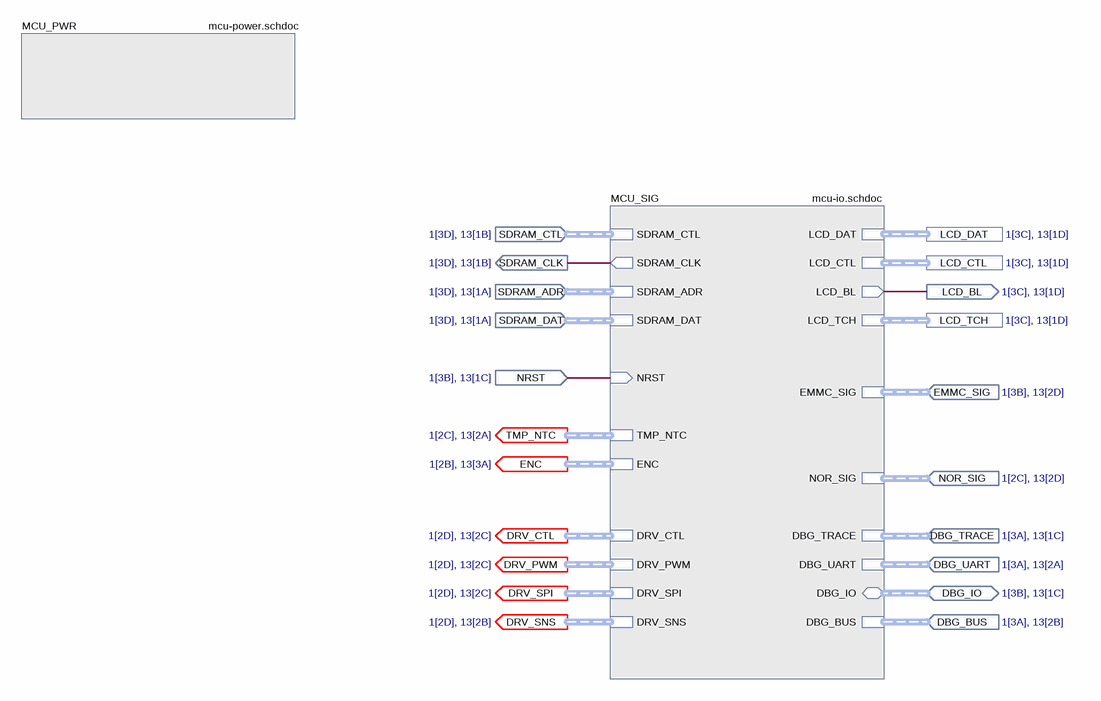
[diagram p4: mcu.schdoc]

### Sub-sheets
MCU_PWR = mcu-power.schdoc: no entries
MCU_SIG = mcu-io.schdoc: SDRAM_CTL (harness SDRAM_CTL), SDRAM_CLK (out), SDRAM_DAT (harness SDRAM_DAT), SDRAM_ADR (harness SDRAM_ADR), NRST (in), DRV_CTL (harness DRV_CTL), DRV_PWM (harness DRV_PWM), DRV_SPI (harness DRV_SPI), DRV_SNS (harness DRV_SNS), LCD_DAT (harness LCD_DAT), LCD_CTL (harness LCD_CTL), LCD_BL (out), LCD_TCH (harness LCD_TCH), EMMC_SIG (harness EMMC_SIG), NOR_SIG (harness NOR_SIG), DBG_TRACE (harness DBG_TRACE), DBG_UART (harness DBG_UART), DBG_IO (bidir, harness DBG_IO), DBG_BUS (harness DBG_BUS), TMP_NTC (harness TMP_NTC), ENC (harness ENC_SIG)

### Ports
DBG_BUS (in, harness DBG_BUS, see 1[3A], 13[2B]), DBG_IO (bidir, harness DBG_IO, see 1[3B], 13[1C]), DBG_TRACE (in, harness DBG_TRACE, see 1[3A], 13[1C]), DBG_UART (in, harness DBG_UART, see 1[3A], 13[2A]), DRV_CTL (out, harness DRV_CTL, see 1[2D], 13[2C]), DRV_PWM (out, harness DRV_PWM, see 1[2D], 13[2C]), DRV_SNS (out, harness DRV_SNS, see 1[2D], 13[2B]), DRV_SPI (out, harness DRV_SPI, see 1[2D], 13[2C]), EMMC_SIG (in, harness EMMC_SIG, see 1[3B], 13[2D]), ENC (out, harness ENC_SIG, see 1[2B], 13[3A]), LCD_BL (out, see 1[3C], 13[1D]), LCD_CTL (harness LCD_CTL, see 1[3C], 13[1D]), LCD_DAT (harness LCD_DAT, see 1[3C], 13[1D]), LCD_TCH (harness LCD_TCH, see 1[3C], 13[1D]), NOR_SIG (in, harness NOR_SIG, see 1[2C], 13[2D]), NRST (in, see 1[3B], 13[1C]), SDRAM_ADR (in, harness SDRAM_ADR, see 1[3D], 13[1A]), SDRAM_CLK (out, see 1[3D], 13[1B]), SDRAM_CTL (in, harness SDRAM_CTL, see 1[3D], 13[1B]), SDRAM_DAT (in, harness SDRAM_DAT, see 1[3D], 13[1A]), TMP_NTC (out, harness TMP_NTC, see 1[2C], 13[2A])

### Nets
BL: port LCD_BL, sheet MCU_SIG/LCD_BL
NRST: port NRST, sheet MCU_SIG/NRST
SDRAM_CLK: port SDRAM_CLK, sheet MCU_SIG/SDRAM_CLK

### Buses and harness runs
harness port DBG_BUS = sheet MCU_SIG/DBG_BUS
harness port DBG_IO = sheet MCU_SIG/DBG_IO
harness port DBG_TRACE = sheet MCU_SIG/DBG_TRACE
harness port DBG_UART = sheet MCU_SIG/DBG_UART
harness port DRV_CTL = sheet MCU_SIG/DRV_CTL
harness port DRV_PWM = sheet MCU_SIG/DRV_PWM
harness port DRV_SNS = sheet MCU_SIG/DRV_SNS
harness port DRV_SPI = sheet MCU_SIG/DRV_SPI
harness port EMMC_SIG = sheet MCU_SIG/EMMC_SIG
harness port ENC = sheet MCU_SIG/ENC
harness port LCD_CTL = sheet MCU_SIG/LCD_CTL
harness port LCD_DAT = sheet MCU_SIG/LCD_DAT
harness port LCD_TCH = sheet MCU_SIG/LCD_TCH
harness port NOR_SIG = sheet MCU_SIG/NOR_SIG
harness port SDRAM_ADR = sheet MCU_SIG/SDRAM_ADR
harness port SDRAM_CTL = sheet MCU_SIG/SDRAM_CTL
harness port SDRAM_DAT = sheet MCU_SIG/SDRAM_DAT
harness port TMP_NTC = sheet MCU_SIG/TMP_NTC

### Notes on the sheet
- DRAWN
- CHECKED
- DRAWNBY
- SHEETS
- SHEETS_NO

## Sheet mcu-power.schdoc: MCUA
size A4; Date: 10.25.2025; CheckedBy: BCY; DrawnBy: miaow; DocumentNumber: 12; Revision: v1.0.0; SheetNumber: 12; SheetTotal: 14; BoardType: MAIN_PCB; Desc: Power subpart of  MCU
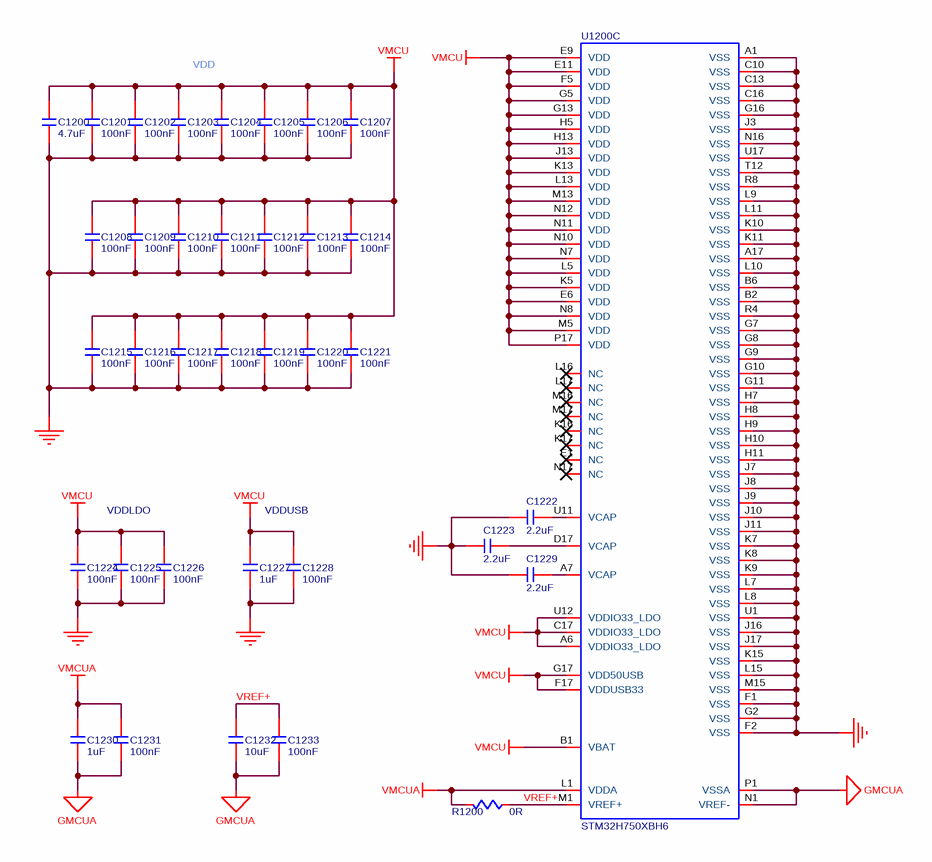
[diagram p5: mcu-power.schdoc]

### Parts
C1200  value 4.7uF  [C0603]  (hidden comment: C-NOMO)
C1201  value 100nF  [C0402]  (hidden comment: C-NOMO)
C1202  value 100nF  [C0402]  (hidden comment: C-NOMO)
C1203  value 100nF  [C0402]  (hidden comment: C-NOMO)
C1204  value 100nF  [C0402]  (hidden comment: C-NOMO)
C1205  value 100nF  [C0402]  (hidden comment: C-NOMO)
C1206  value 100nF  [C0402]  (hidden comment: C-NOMO)
C1207  value 100nF  [C0402]  (hidden comment: C-NOMO)
C1208  value 100nF  [C0402]  (hidden comment: C-NOMO)
C1209  value 100nF  [C0402]  (hidden comment: C-NOMO)
C1210  value 100nF  [C0402]  (hidden comment: C-NOMO)
C1211  value 100nF  [C0402]  (hidden comment: C-NOMO)
C1212  value 100nF  [C0402]  (hidden comment: C-NOMO)
C1213  value 100nF  [C0402]  (hidden comment: C-NOMO)
C1214  value 100nF  [C0402]  (hidden comment: C-NOMO)
C1215  value 100nF  [C0402]  (hidden comment: C-NOMO)
C1216  value 100nF  [C0402]  (hidden comment: C-NOMO)
C1217  value 100nF  [C0402]  (hidden comment: C-NOMO)
C1218  value 100nF  [C0402]  (hidden comment: C-NOMO)
C1219  value 100nF  [C0402]  (hidden comment: C-NOMO)
C1220  value 100nF  [C0402]  (hidden comment: C-NOMO)
C1221  value 100nF  [C0402]  (hidden comment: C-NOMO)
C1222  value 2.2uF  [C0402]  (hidden comment: C-NOMO)
C1223  value 2.2uF  [C0402]  (hidden comment: C-NOMO)
C1224  value 100nF  [C0402]  (hidden comment: C-NOMO)
C1225  value 100nF  [C0402]  (hidden comment: C-NOMO)
C1226  value 100nF  [C0402]  (hidden comment: C-NOMO)
C1227  value 1uF  [C0603]  (hidden comment: C-NOMO)
C1228  value 100nF  [C0402]  (hidden comment: C-NOMO)
C1229  value 2.2uF  [C0402]  (hidden comment: C-NOMO)
C1230  value 1uF  [C0603]  (hidden comment: C-NOMO)
C1231  value 100nF  [C0402]  (hidden comment: C-NOMO)
C1232  value 10uF  [C0805]  (hidden comment: C-NOMO)
C1233  value 100nF  [C0402]  (hidden comment: C-NOMO)
R1200  value 0R  [R0603]  (hidden comment: R)
U1200  STM32H750XBH6  [STM32H750XBH6]  (part C of 3)

### Nets
GMCUA: C1200.1 C1201.1 C1202.1 C1203.1 C1204.1 C1205.1 C1206.1 C1207.1 C1208.1 C1209.1 C1210.1 C1211.1 C1212.1 C1213.1 C1214.1 C1215.1 C1216.1 C1217.1 C1218.1 C1219.1 C1220.1 C1221.1 C1222.1 C1223.1 C1224.1 C1225.1 C1226.1 C1227.1 C1228.1 C1229.1 C1230.1 C1231.1 C1232.1 C1233.1 U1200.A1(VSS) U1200.A17(VSS) U1200.B2(VSS) U1200.B6(VSS) U1200.C10(VSS) U1200.C13(VSS) U1200.C16(VSS) U1200.F1(VSS) U1200.F2(VSS) U1200.G2(VSS) U1200.G7(VSS) U1200.G8(VSS) U1200.G9(VSS) U1200.G10(VSS) U1200.G11(VSS) U1200.G16(VSS) U1200.H7(VSS) U1200.H8(VSS) U1200.H9(VSS) U1200.H10(VSS) U1200.H11(VSS) U1200.J3(VSS) U1200.J7(VSS) U1200.J8(VSS) U1200.J9(VSS) U1200.J10(VSS) U1200.J11(VSS) U1200.J16(VSS) U1200.J17(VSS) U1200.K7(VSS) U1200.K8(VSS) U1200.K9(VSS) U1200.K10(VSS) U1200.K11(VSS) U1200.K15(VSS) U1200.L7(VSS) U1200.L8(VSS) U1200.L9(VSS) U1200.L10(VSS) U1200.L11(VSS) U1200.L15(VSS) U1200.M15(VSS) U1200.N1(VREF-) U1200.N16(VSS) U1200.P1(VSSA) U1200.R4(VSS) U1200.R8(VSS) U1200.T12(VSS) U1200.U1(VSS) U1200.U17(VSS)  [also labelled GND]  [project net GDRVA]
VMCU: C1200.2 C1201.2 C1202.2 C1203.2 C1204.2 C1205.2 C1206.2 C1207.2 C1208.2 C1209.2 C1210.2 C1211.2 C1212.2 C1213.2 C1214.2 C1215.2 C1216.2 C1217.2 C1218.2 C1219.2 C1220.2 C1221.2 C1224.2 C1225.2 C1226.2 C1227.2 C1228.2 U1200.A6(VDDIO33_LDO) U1200.B1(VBAT) U1200.C17(VDDIO33_LDO) U1200.E6(VDD) U1200.E9(VDD) U1200.E11(VDD) U1200.F5(VDD) U1200.F17(VDDUSB33) U1200.G5(VDD) U1200.G13(VDD) U1200.G17(VDD50USB) U1200.H5(VDD) U1200.H13(VDD) U1200.J13(VDD) U1200.K5(VDD) U1200.K13(VDD) U1200.L5(VDD) U1200.L13(VDD) U1200.M5(VDD) U1200.M13(VDD) U1200.N7(VDD) U1200.N8(VDD) U1200.N10(VDD) U1200.N11(VDD) U1200.N12(VDD) U1200.P17(VDD) U1200.U12(VDDIO33_LDO)  [project net +3V3]
VMCUA: C1230.2 C1231.2 R1200.1 U1200.L1(VDDA)
VREF+: C1232.2 C1233.2 R1200.2 U1200.M1(VREF+)
NetC1222_2: C1222.2 U1200.U11(VCAP)
NetC1223_2: C1223.2 U1200.D17(VCAP)
NetC1229_2: C1229.2 U1200.A7(VCAP)

Not connected (* = marked no-connect by the designer): U1200 E1(NC)* K16(NC)* K17(NC)* L16(NC)* L17(NC)* M16(NC)* M17(NC)* N17(NC)*

### Notes on the sheet
- VDD
- VDDLDO
- VDDUSB
- DRAWN
- CHECKED
- DRAWNBY
- SHEETS
- SHEETS_NO

### Library data of the parts
C1200-C1233 = C-NOMO: voltage: 25V; precision: 5%
R1200 = R: precision: 1%
U1200 = STM32H750XBH6: MCU; Supplier 1: LCSC; Supplier Part Number 1: C405932

## Sheet mcu-io.schdoc: MCUB
size A4; Date: 10.25.2025; CheckedBy: BCY; DrawnBy: miaow; DocumentNumber: 13; Revision: v1.1.0; SheetNumber: 13; SheetTotal: 14; BoardType: MAIN_PCB; Desc: IO sub part of MCU
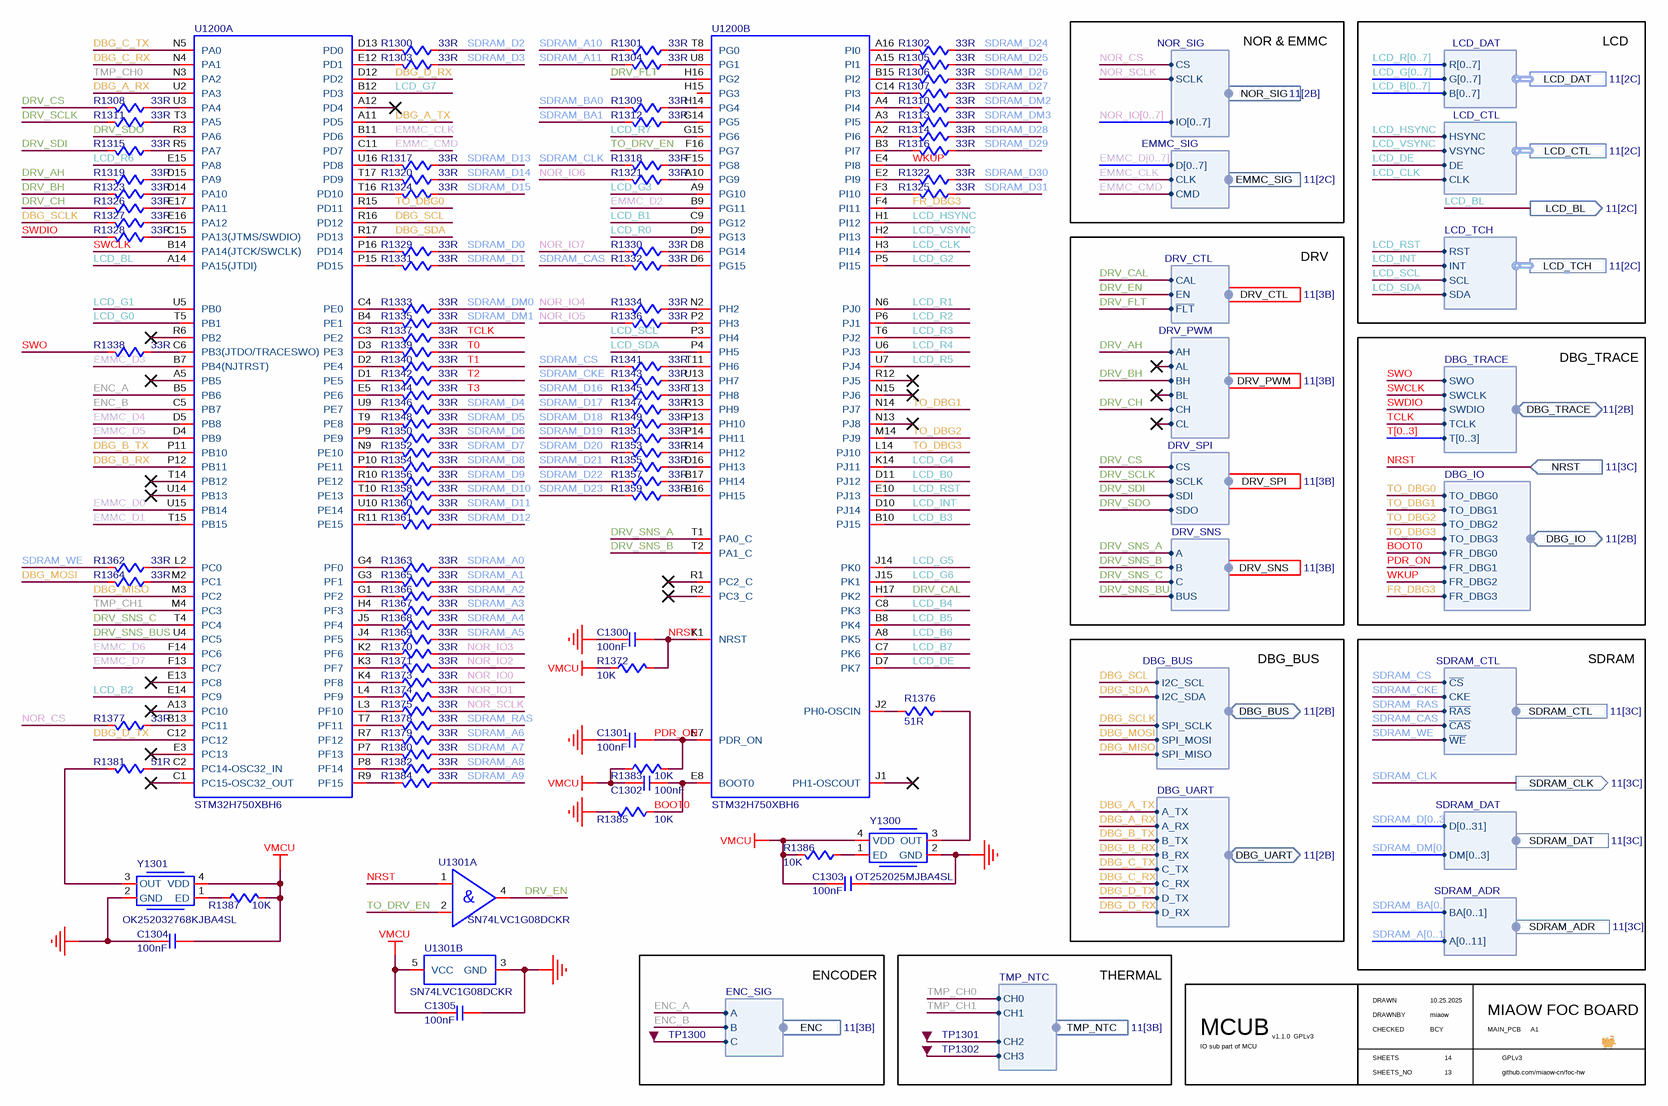
[diagram p6: mcu-io.schdoc]

### Parts
C1300  value 100nF  [C0402]  (hidden comment: C-NOMO)
C1301  value 100nF  [C0402]  (hidden comment: C-NOMO)
C1302  value 100nF  [C0402]  (hidden comment: C-NOMO)
C1303  value 100nF  [C0402]  (hidden comment: C-NOMO)
C1304  value 100nF  [C0402]  (hidden comment: C-NOMO)
C1305  value 100nF  [C0402]  (hidden comment: C-NOMO)
R1300  value 33R  [R0402]  (hidden comment: R)
R1301  value 33R  [R0402]  (hidden comment: R)
R1302  value 33R  [R0402]  (hidden comment: R)
R1303  value 33R  [R0402]  (hidden comment: R)
R1304  value 33R  [R0402]  (hidden comment: R)
R1305  value 33R  [R0402]  (hidden comment: R)
R1306  value 33R  [R0402]  (hidden comment: R)
R1307  value 33R  [R0402]  (hidden comment: R)
R1308  value 33R  [R0402]  (hidden comment: R)
R1309  value 33R  [R0402]  (hidden comment: R)
R1310  value 33R  [R0402]  (hidden comment: R)
R1311  value 33R  [R0402]  (hidden comment: R)
R1312  value 33R  [R0402]  (hidden comment: R)
R1313  value 33R  [R0402]  (hidden comment: R)
R1314  value 33R  [R0402]  (hidden comment: R)
R1315  value 33R  [R0402]  (hidden comment: R)
R1316  value 33R  [R0402]  (hidden comment: R)
R1317  value 33R  [R0402]  (hidden comment: R)
R1318  value 33R  [R0402]  (hidden comment: R)
R1319  value 33R  [R0402]  (hidden comment: R)
R1320  value 33R  [R0402]  (hidden comment: R)
R1321  value 33R  [R0402]  (hidden comment: R)
R1322  value 33R  [R0402]  (hidden comment: R)
R1323  value 33R  [R0402]  (hidden comment: R)
R1324  value 33R  [R0402]  (hidden comment: R)
R1325  value 33R  [R0402]  (hidden comment: R)
R1326  value 33R  [R0402]  (hidden comment: R)
R1327  value 33R  [R0402]  (hidden comment: R)
R1328  value 33R  [R0402]  (hidden comment: R)
R1329  value 33R  [R0402]  (hidden comment: R)
R1330  value 33R  [R0402]  (hidden comment: R)
R1331  value 33R  [R0402]  (hidden comment: R)
R1332  value 33R  [R0402]  (hidden comment: R)
R1333  value 33R  [R0402]  (hidden comment: R)
R1334  value 33R  [R0402]  (hidden comment: R)
R1335  value 33R  [R0402]  (hidden comment: R)
R1336  value 33R  [R0402]  (hidden comment: R)
R1337  value 33R  [R0402]  (hidden comment: R)
R1338  value 33R  [R0402]  (hidden comment: R)
R1339  value 33R  [R0402]  (hidden comment: R)
R1340  value 33R  [R0402]  (hidden comment: R)
R1341  value 33R  [R0402]  (hidden comment: R)
R1342  value 33R  [R0402]  (hidden comment: R)
R1343  value 33R  [R0402]  (hidden comment: R)
R1344  value 33R  [R0402]  (hidden comment: R)
R1345  value 33R  [R0402]  (hidden comment: R)
R1346  value 33R  [R0402]  (hidden comment: R)
R1347  value 33R  [R0402]  (hidden comment: R)
R1348  value 33R  [R0402]  (hidden comment: R)
R1349  value 33R  [R0402]  (hidden comment: R)
R1350  value 33R  [R0402]  (hidden comment: R)
R1351  value 33R  [R0402]  (hidden comment: R)
R1352  value 33R  [R0402]  (hidden comment: R)
R1353  value 33R  [R0402]  (hidden comment: R)
R1354  value 33R  [R0402]  (hidden comment: R)
R1355  value 33R  [R0402]  (hidden comment: R)
R1356  value 33R  [R0402]  (hidden comment: R)
R1357  value 33R  [R0402]  (hidden comment: R)
R1358  value 33R  [R0402]  (hidden comment: R)
R1359  value 33R  [R0402]  (hidden comment: R)
R1360  value 33R  [R0402]  (hidden comment: R)
R1361  value 33R  [R0402]  (hidden comment: R)
R1362  value 33R  [R0402]  (hidden comment: R)
R1363  value 33R  [R0402]  (hidden comment: R)
R1364  value 33R  [R0402]  (hidden comment: R)
R1365  value 33R  [R0402]  (hidden comment: R)
R1366  value 33R  [R0402]  (hidden comment: R)
R1367  value 33R  [R0402]  (hidden comment: R)
R1368  value 33R  [R0402]  (hidden comment: R)
R1369  value 33R  [R0402]  (hidden comment: R)
R1370  value 33R  [R0402]  (hidden comment: R)
R1371  value 33R  [R0402]  (hidden comment: R)
R1372  value 10K  [R0402]  (hidden comment: R)
R1373  value 33R  [R0402]  (hidden comment: R)
R1374  value 33R  [R0402]  (hidden comment: R)
R1375  value 33R  [R0402]  (hidden comment: R)
R1376  value 51R  [R0402]  (hidden comment: R)
R1377  value 33R  [R0402]  (hidden comment: R)
R1378  value 33R  [R0402]  (hidden comment: R)
R1379  value 33R  [R0402]  (hidden comment: R)
R1380  value 33R  [R0402]  (hidden comment: R)
R1381  value 51R  [R0402]  (hidden comment: R)
R1382  value 33R  [R0402]  (hidden comment: R)
R1383  value 10K  [R0402]  (hidden comment: R)
R1384  value 33R  [R0402]  (hidden comment: R)
R1385  value 10K  [R0402]  (hidden comment: R)
R1386  value 10K  [R0402]  (hidden comment: R)
R1387  value 10K  [R0402]  (hidden comment: R)
TP1300  TP  [TP]  (value not drawn)
TP1301  TP  [TP]  (value not drawn)
TP1302  TP  [TP]  (value not drawn)
U1200  STM32H750XBH6  [STM32H750XBH6]  (parts A,B of 3)
U1301  SN74LVC1G08DCKR  [SN74LVC1G08DCKR]  (parts A,B of 2)
Y1300  OT252025MJBA4SL  [OT252025MJBA4SL]
Y1301  OK252032768KJBA4SL  [OK252032768KJBA4SL]

### Blocks framed on the sheet
ENCODER: TP1300
THERMAL: TP1301 TP1302

### Ports
DBG_BUS (bidir, harness DBG_BUS, see 11[2B]), DBG_IO (bidir, harness DBG_IO, see 11[2B]), DBG_TRACE (bidir, harness DBG_TRACE, see 11[2B]), DBG_UART (bidir, harness DBG_UART, see 11[2B]), DRV_CTL (out, harness DRV_CTL, see 11[3B]), DRV_PWM (out, harness DRV_PWM, see 11[3B]), DRV_SNS (out, harness DRV_SNS, see 11[3B]), DRV_SPI (out, harness DRV_SPI, see 11[3B]), EMMC_SIG (in, harness EMMC_SIG, see 11[2C]), ENC (in, harness ENC_SIG, see 11[3B]), LCD_BL (out, see 11[2C]), LCD_CTL (harness LCD_CTL, see 11[2C]), LCD_DAT (harness LCD_DAT, see 11[2C]), LCD_TCH (harness LCD_TCH, see 11[2C]), NOR_SIG (in, harness NOR_SIG, see 11[2B]), NRST (in, see 11[3C]), SDRAM_ADR (harness SDRAM_ADR, see 11[3C]), SDRAM_CLK (out, see 11[3C]), SDRAM_CTL (harness SDRAM_CTL, see 11[3C]), SDRAM_DAT (harness SDRAM_DAT, see 11[3C]), TMP_NTC (in, harness TMP_NTC, see 11[3B])

### Harnesses
SDRAM_DAT: DM[0..3], D[0..31]
SDRAM_ADR: BA[0..1], A[0..11]
SDRAM_CTL: ~{CS}, CKE, ~{RAS}, ~{CAS}, ~{WE}
DRV_CTL: CAL, EN, ~{FLT}
DRV_SNS: C, B, A, BUS
DRV_SPI: CS, SCLK, SDI, SDO
DRV_PWM: AH, AL, BH, BL, CH, CL
LCD_DAT: R[0..7], G[0..7], B[0..7]
LCD_CTL: HSYNC, VSYNC, DE, CLK
LCD_TCH: SDA, SCL, INT, RST
EMMC_SIG: D[0..7], CLK, CMD
NOR_SIG: CS, SCLK, IO[0..7]
DBG_UART: A_TX, A_RX, B_TX, B_RX, C_TX, C_RX, D_TX, D_RX
DBG_BUS: I2C_SDA, I2C_SCL, SPI_MISO, SPI_MOSI, SPI_SCLK
DBG_TRACE: SWO, SWCLK, SWDIO, TCLK, T[0..3]
DBG_IO: TO_DBG0, TO_DBG1, FR_DBG0, TO_DBG3, TO_DBG2, FR_DBG1, FR_DBG2, FR_DBG3
TMP_NTC: CH0, CH1, CH2, CH3
ENC_SIG: A, B, C

### Nets
GND: C1300.2 C1301.2 C1303.2 C1304.2 C1305.2 R1385.1 U1301.3(GND) Y1300.2(GND) Y1301.2(GND)  [project net GDRVA]
VMCU: C1302.2 C1303.1 C1304.1 C1305.1 R1372.1 R1383.2 R1386.1 R1387.1 U1301.5(VCC) Y1300.4(VDD) Y1301.4(VDD)  [project net +3V3]
BOOT0: C1302.1 R1385.2 U1200.E8(BOOT0) ; port DBG_IO.FR_DBG0
DBG_A_RX: U1200.U2(PA3) ; port DBG_UART.A_RX
DBG_A_TX: U1200.A11(PD5) ; port DBG_UART.A_TX
DBG_B_RX: U1200.P12(PB11) ; port DBG_UART.B_RX
DBG_B_TX: U1200.P11(PB10) ; port DBG_UART.B_TX
DBG_C_RX: U1200.N4(PA1) ; port DBG_UART.C_RX
DBG_C_TX: U1200.N5(PA0) ; port DBG_UART.C_TX
DBG_D_RX: U1200.D12(PD2) ; port DBG_UART.D_RX
DBG_D_TX: U1200.C12(PC12) ; port DBG_UART.D_TX
DBG_MISO: U1200.M3(PC2) ; port DBG_BUS.SPI_MISO
DBG_MOSI: R1364.2 ; port DBG_BUS.SPI_MOSI
DBG_SCL: U1200.R16(PD12) ; port DBG_BUS.I2C_SCL
DBG_SCLK: R1327.2 ; port DBG_BUS.SPI_SCLK
DBG_SDA: U1200.R17(PD13) ; port DBG_BUS.I2C_SDA
DRV_AH: R1319.2 ; port DRV_PWM.AH  [project net 9_37]
DRV_BH: R1323.2 ; port DRV_PWM.BH  [project net 9_39]
DRV_CAL: U1200.H17(PK2) ; port DRV_CTL.CAL  [project net 9_34]
DRV_CH: R1326.2 ; port DRV_PWM.CH  [project net 9_41]
DRV_CS: R1308.2 ; port DRV_SPI.CS
DRV_EN: U1301.4(Y) ; port DRV_CTL.EN  [project net 9_33]
DRV_FLT: U1200.H16(PG2) ; port DRV_CTL.~{FLT}
DRV_SCLK: R1311.2 ; port DRV_SPI.SCLK
DRV_SDI: R1315.2 ; port DRV_SPI.SDI  [project net 9_30]
DRV_SDO: U1200.R3(PA6) ; port DRV_SPI.SDO
DRV_SNS_A: U1200.T1(PA0_C) ; port DRV_SNS.A
DRV_SNS_B: U1200.T2(PA1_C) ; port DRV_SNS.B
DRV_SNS_BUS: U1200.U4(PC5) ; port DRV_SNS.BUS  [project net 9_VBUS]
DRV_SNS_C: U1200.T4(PC4) ; port DRV_SNS.C
EMMC_CLK: U1200.B11(PD6) ; port EMMC_SIG.CLK
EMMC_CMD: U1200.C11(PD7) ; port EMMC_SIG.CMD  [project net CMD]
EMMC_D0: U1200.U15(PB14)
EMMC_D1: U1200.T15(PB15)
EMMC_D2: U1200.B9(PG11)
EMMC_D3: U1200.B7(PB4(NJTRST))
EMMC_D4: U1200.D5(PB8)
EMMC_D5: U1200.D4(PB9)
EMMC_D6: U1200.F14(PC6)
EMMC_D7: U1200.F13(PC7)
ENC_A: U1200.B5(PB6) ; port ENC.A
ENC_B: U1200.C5(PB7) ; port ENC.B
FR_DBG3: U1200.F4(PI11) ; port DBG_IO.FR_DBG3
LCD_B0: U1200.D11(PJ12)  [project net B0]
LCD_B1: U1200.C9(PG12)  [project net B1]
LCD_B2: U1200.E14(PC9)  [project net B2]
LCD_B3: U1200.B10(PJ15)  [project net B3]
LCD_B4: U1200.C8(PK3)  [project net B4]
LCD_B5: U1200.B8(PK4)  [project net B5]
LCD_B6: U1200.A8(PK5)  [project net B6]
LCD_B7: U1200.C7(PK6)  [project net B7]
LCD_BL: U1200.A14(PA15(JTDI)) ; port LCD_BL  [project net BL]
LCD_CLK: U1200.H3(PI14) ; port LCD_CTL.CLK  [project net CLK]
LCD_DE: U1200.D7(PK7) ; port LCD_CTL.DE  [project net DE]
LCD_G0: U1200.T5(PB1)  [project net G0]
LCD_G1: U1200.U5(PB0)  [project net G1]
LCD_G2: U1200.P5(PI15)  [project net G2]
LCD_G3: U1200.A9(PG10)  [project net G3]
LCD_G4: U1200.K14(PJ11)  [project net G4]
LCD_G5: U1200.J14(PK0)  [project net G5]
LCD_G6: U1200.J15(PK1)  [project net G6]
LCD_G7: U1200.B12(PD3)  [project net G7]
LCD_HSYNC: U1200.H1(PI12) ; port LCD_CTL.HSYNC  [project net HSYNC]
LCD_INT: U1200.D10(PJ14) ; port LCD_TCH.INT
LCD_R0: U1200.D9(PG13)
LCD_R1: U1200.N6(PJ0)
LCD_R2: U1200.P6(PJ1)
LCD_R3: U1200.T6(PJ2)
LCD_R4: U1200.U6(PJ3)
LCD_R5: U1200.U7(PJ4)
LCD_R6: U1200.E15(PA8)
LCD_R7: U1200.G15(PG6)
LCD_RST: U1200.E10(PJ13) ; port LCD_TCH.RST
LCD_SCL: U1200.P3(PH4) ; port LCD_TCH.SCL
LCD_SDA: U1200.P4(PH5) ; port LCD_TCH.SDA
LCD_VSYNC: U1200.H2(PI13) ; port LCD_CTL.VSYNC
NOR_CS: R1377.2 ; port NOR_SIG.CS
NOR_IO0: R1373.2
NOR_IO1: R1374.2
NOR_IO2: R1371.2
NOR_IO3: R1370.2
NOR_IO4: R1334.2
NOR_IO5: R1336.2
NOR_IO6: R1321.2
NOR_IO7: R1330.2
NOR_SCLK: R1375.2 ; port NOR_SIG.SCLK
NRST: C1300.1 R1372.2 U1200.K1(NRST) U1301.1(A) ; port NRST
PDR_ON: C1301.1 R1383.1 U1200.E7(PDR_ON) ; port DBG_IO.FR_DBG1  [project net FR_DBG1]
SDRAM_A0: R1363.2  [project net A0]
SDRAM_A1: R1365.2  [project net A1]
SDRAM_A2: R1366.2  [project net A2]
SDRAM_A3: R1367.2  [project net A3]
SDRAM_A4: R1368.2  [project net A4]
SDRAM_A5: R1369.2  [project net A5]
SDRAM_A6: R1379.2  [project net A6]
SDRAM_A7: R1380.2  [project net A7]
SDRAM_A8: R1382.2  [project net A8]
SDRAM_A9: R1384.2  [project net A9]
SDRAM_A10: R1301.2  [project net A10]
SDRAM_A11: R1304.2  [project net A11]
SDRAM_BA0: R1309.2  [project net BA0]
SDRAM_BA1: R1312.2  [project net BA1]
SDRAM_CAS: R1332.2 ; port SDRAM_CTL.~{CAS}
SDRAM_CKE: R1343.2 ; port SDRAM_CTL.CKE
SDRAM_CLK: R1318.2 ; port SDRAM_CLK
SDRAM_CS: R1341.2 ; port SDRAM_CTL.~{CS}
SDRAM_D0: R1329.2  [project net D0]
SDRAM_D1: R1331.2  [project net D1]
SDRAM_D2: R1300.2  [project net D2]
SDRAM_D3: R1303.2  [project net D3]
SDRAM_D4: R1346.2  [project net D4]
SDRAM_D5: R1348.2  [project net D5]
SDRAM_D6: R1350.2  [project net D6]
SDRAM_D7: R1352.2  [project net D7]
SDRAM_D8: R1354.2  [project net D8]
SDRAM_D9: R1356.2  [project net D9]
SDRAM_D10: R1358.2  [project net D10]
SDRAM_D11: R1360.2  [project net D11]
SDRAM_D12: R1361.2  [project net D12]
SDRAM_D13: R1317.2  [project net D13]
SDRAM_D14: R1320.2  [project net D14]
SDRAM_D15: R1324.2  [project net D15]
SDRAM_D16: R1345.2  [project net D16]
SDRAM_D17: R1347.2  [project net D17]
SDRAM_D18: R1349.2  [project net D18]
SDRAM_D19: R1351.2  [project net D19]
SDRAM_D20: R1353.2  [project net D20]
SDRAM_D21: R1355.2  [project net D21]
SDRAM_D22: R1357.2  [project net D22]
SDRAM_D23: R1359.2  [project net D23]
SDRAM_D24: R1302.2  [project net D24]
SDRAM_D25: R1305.2  [project net D25]
SDRAM_D26: R1306.2  [project net D26]
SDRAM_D27: R1307.2  [project net D27]
SDRAM_D28: R1314.2  [project net D28]
SDRAM_D29: R1316.2  [project net D29]
SDRAM_D30: R1322.2  [project net D30]
SDRAM_D31: R1325.2  [project net D31]
SDRAM_DM0: R1333.2  [project net DM0]
SDRAM_DM1: R1335.2  [project net DM1]
SDRAM_DM2: R1310.2  [project net DM2]
SDRAM_DM3: R1313.2  [project net DM3]
SDRAM_RAS: R1378.2 ; port SDRAM_CTL.~{RAS}
SDRAM_WE: R1362.2 ; port SDRAM_CTL.~{WE}
SWCLK: U1200.B14(PA14(JTCK/SWCLK)) ; port DBG_TRACE.SWCLK
SWDIO: R1328.2 ; port DBG_TRACE.SWDIO
SWO: R1338.2 ; port DBG_TRACE.SWO
T0: R1339.2
T1: R1340.2
T2: R1342.2
T3: R1344.2
TCLK: R1337.2 ; port DBG_TRACE.TCLK
TMP_CH0: U1200.N3(PA2) ; port TMP_NTC.CH0
TMP_CH1: U1200.M4(PC3) ; port TMP_NTC.CH1
TO_DBG0: U1200.R15(PD11) ; port DBG_IO.TO_DBG0
TO_DBG1: U1200.N14(PJ7) ; port DBG_IO.TO_DBG1
TO_DBG2: U1200.M14(PJ9) ; port DBG_IO.TO_DBG2
TO_DBG3: U1200.L14(PJ10) ; port DBG_IO.TO_DBG3
TO_DRV_EN: U1200.F16(PG7) U1301.2(B)
WKUP: U1200.E4(PI8) ; port DBG_IO.FR_DBG2  [project net FR_DBG2]
NetC804_1: TP1301.0 ; port TMP_NTC.CH2
NetC805_1: TP1302.0 ; port TMP_NTC.CH3
NetR1004_1: TP1300.0 ; port ENC.C
NetR1300_1: R1300.1 U1200.D13(PD0)
NetR1301_1: R1301.1 U1200.T8(PG0)
NetR1302_1: R1302.1 U1200.A16(PI0)
NetR1303_1: R1303.1 U1200.E12(PD1)
NetR1304_1: R1304.1 U1200.U8(PG1)
NetR1305_1: R1305.1 U1200.A15(PI1)
NetR1306_1: R1306.1 U1200.B15(PI2)
NetR1307_1: R1307.1 U1200.C14(PI3)
NetR1308_1: R1308.1 U1200.U3(PA4)
NetR1309_1: R1309.1 U1200.H14(PG4)
NetR1310_1: R1310.1 U1200.A4(PI4)
NetR1311_1: R1311.1 U1200.T3(PA5)
NetR1312_1: R1312.1 U1200.G14(PG5)
NetR1313_1: R1313.1 U1200.A3(PI5)
NetR1314_1: R1314.1 U1200.A2(PI6)
NetR1315_1: R1315.1 U1200.R5(PA7)
NetR1316_1: R1316.1 U1200.B3(PI7)
NetR1317_1: R1317.1 U1200.U16(PD8)
NetR1318_1: R1318.1 U1200.F15(PG8)
NetR1319_1: R1319.1 U1200.D15(PA9)
NetR1320_1: R1320.1 U1200.T17(PD9)
NetR1321_1: R1321.1 U1200.A10(PG9)
NetR1322_1: R1322.1 U1200.E2(PI9)
NetR1323_1: R1323.1 U1200.D14(PA10)
NetR1324_1: R1324.1 U1200.T16(PD10)
NetR1325_1: R1325.1 U1200.F3(PI10)
NetR1326_1: R1326.1 U1200.E17(PA11)
NetR1327_1: R1327.1 U1200.E16(PA12)
NetR1328_1: R1328.1 U1200.C15(PA13(JTMS/SWDIO))
NetR1329_1: R1329.1 U1200.P16(PD14)
NetR1330_1: R1330.1 U1200.D8(PG14)
NetR1331_1: R1331.1 U1200.P15(PD15)
NetR1332_1: R1332.1 U1200.D6(PG15)
NetR1333_1: R1333.1 U1200.C4(PE0)
NetR1334_1: R1334.1 U1200.N2(PH2)
NetR1335_1: R1335.1 U1200.B4(PE1)
NetR1336_1: R1336.1 U1200.P2(PH3)
NetR1337_1: R1337.1 U1200.C3(PE2)
NetR1338_1: R1338.1 U1200.C6(PB3(JTDO/TRACESWO))
NetR1339_1: R1339.1 U1200.D3(PE3)
NetR1340_1: R1340.1 U1200.D2(PE4)
NetR1341_1: R1341.1 U1200.T11(PH6)
NetR1342_1: R1342.1 U1200.D1(PE5)
NetR1343_1: R1343.1 U1200.U13(PH7)
NetR1344_1: R1344.1 U1200.E5(PE6)
NetR1345_1: R1345.1 U1200.T13(PH8)
NetR1346_1: R1346.1 U1200.U9(PE7)
NetR1347_1: R1347.1 U1200.R13(PH9)
NetR1348_1: R1348.1 U1200.T9(PE8)
NetR1349_1: R1349.1 U1200.P13(PH10)
NetR1350_1: R1350.1 U1200.P9(PE9)
NetR1351_1: R1351.1 U1200.P14(PH11)
NetR1352_1: R1352.1 U1200.N9(PE10)
NetR1353_1: R1353.1 U1200.R14(PH12)
NetR1354_1: R1354.1 U1200.P10(PE11)
NetR1355_1: R1355.1 U1200.D16(PH13)
NetR1356_1: R1356.1 U1200.R10(PE12)
NetR1357_1: R1357.1 U1200.B17(PH14)
NetR1358_1: R1358.1 U1200.T10(PE13)
NetR1359_1: R1359.1 U1200.B16(PH15)
NetR1360_1: R1360.1 U1200.U10(PE14)
NetR1361_1: R1361.1 U1200.R11(PE15)
NetR1362_1: R1362.1 U1200.L2(PC0)
NetR1363_1: R1363.1 U1200.G4(PF0)
NetR1364_1: R1364.1 U1200.M2(PC1)
NetR1365_1: R1365.1 U1200.G3(PF1)
NetR1366_1: R1366.1 U1200.G1(PF2)
NetR1367_1: R1367.1 U1200.H4(PF3)
NetR1368_1: R1368.1 U1200.J5(PF4)
NetR1369_1: R1369.1 U1200.J4(PF5)
NetR1370_1: R1370.1 U1200.K2(PF6)
NetR1371_1: R1371.1 U1200.K3(PF7)
NetR1373_1: R1373.1 U1200.K4(PF8)
NetR1374_1: R1374.1 U1200.L4(PF9)
NetR1375_1: R1375.1 U1200.L3(PF10)
NetR1376_1: R1376.1 U1200.J2(PH0-OSCIN)
NetR1376_2: R1376.2 Y1300.3(OUT)
NetR1377_1: R1377.1 U1200.B13(PC11)
NetR1378_1: R1378.1 U1200.T7(PF11)
NetR1379_1: R1379.1 U1200.R7(PF12)
NetR1380_1: R1380.1 U1200.P7(PF13)
NetR1381_1: R1381.1 Y1301.3(OUT)
NetR1381_2: R1381.2 U1200.C2(PC14-OSC32_IN)
NetR1382_1: R1382.1 U1200.P8(PF14)
NetR1384_1: R1384.1 U1200.R9(PF15)
NetR1386_2: R1386.2 Y1300.1(ED)
NetR1387_2: R1387.2 Y1301.1(ED)

Not connected (* = marked no-connect by the designer): U1200 A5(PB5)* A12(PD4)* A13(PC10)* C1(PC15-OSC32_OUT)* E3(PC13)* E13(PC8)* H15(PG3) J1(PH1-OSCOUT)* N13(PJ8)* N15(PJ6)* R1(PC2_C)* R2(PC3_C)* R6(PB2)* R12(PJ5)* T14(PB12)* U14(PB13)*

### Buses and harness runs
bus EMMC_D[0..7]
bus LCD_B[0..7]
bus LCD_G[0..7]
bus LCD_R[0..7]
bus NOR_IO[0..7]
bus SDRAM_A[0..11]
bus SDRAM_BA[0..1]
bus SDRAM_D[0..31]
bus SDRAM_DM[0..3]
bus T[0..3]

### Notes on the sheet
- NOR & EMMC
- LCD
- DRV
- DBG_TRACE
- DBG_BUS
- SDRAM
- DRAWN
- CHECKED
- DRAWNBY
- SHEETS
- SHEETS_NO
- (in symbol SN74LVC1G08DCKR, part A) &

### Library data of the parts
C1300-C1305 = C-NOMO: voltage: 25V; precision: 5%
R1300-R1387 = R: precision: 1%
U1200 = STM32H750XBH6: MCU; Supplier 1: LCSC; Supplier Part Number 1: C405932
U1301 = SN74LVC1G08DCKR: AND GATE  - 1bit; Supplier 1: LCSC; Supplier Part Number 1: C7832
Y1300 = OT252025MJBA4SL: value: 25MHz; Supplier 1: LCSC; Supplier Part Number 1: C717683
Y1301 = OK252032768KJBA4SL: value: 32.768KHz; Supplier 1: LCSC; Supplier Part Number 1: C669098

## Sheet lcd.schdoc: LCD
size A4; Date: 10.25.2025; CheckedBy: BCY; DrawnBy: miaow; DocumentNumber: 6; Revision: v1.0.0; SheetNumber: 6; SheetTotal: 14; BoardType: MAIN_PCB; Desc: RGB LCD interface
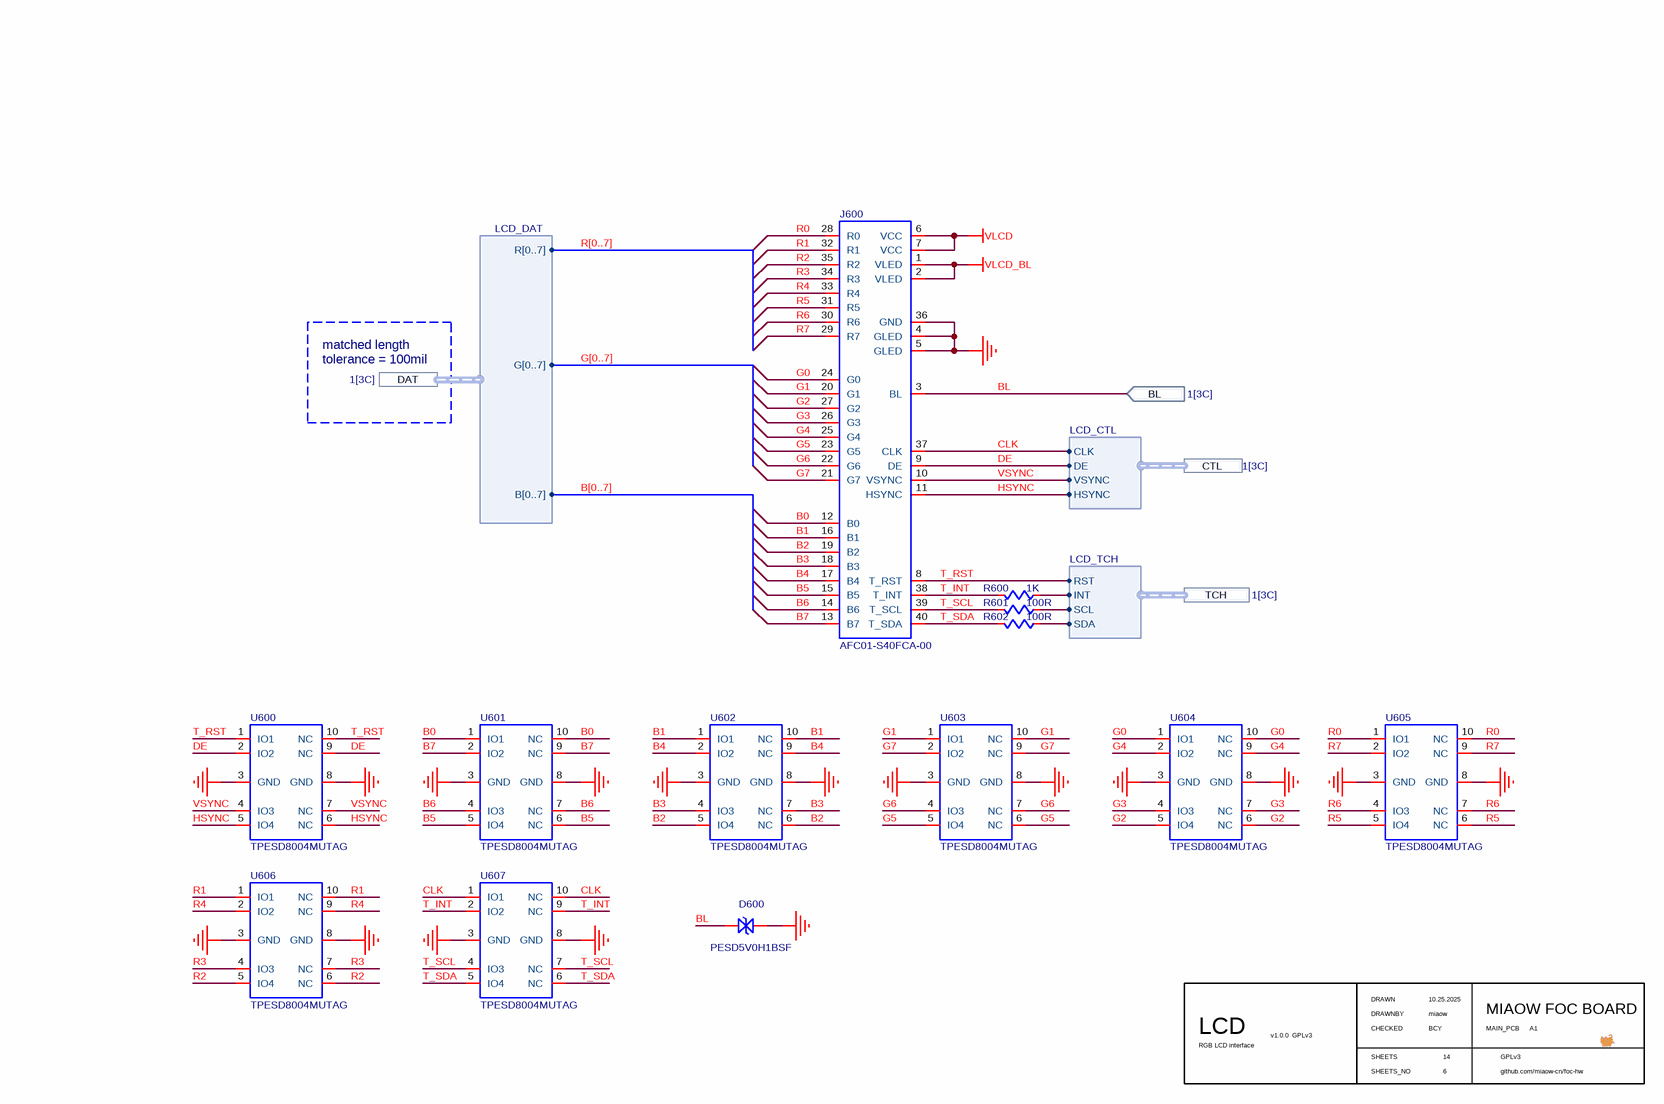
[diagram p7: lcd.schdoc]

### Parts
D600  PESD5V0H1BSF  [PESD5V0H1BSF]
J600  AFC01-S40FCA-00  [AFC01-S40FCA-00]
R600  value 1K  [R0402]  (hidden comment: R)
R601  value 100R  [R0402]  (hidden comment: R)
R602  value 100R  [R0402]  (hidden comment: R)
U600  TPESD8004MUTAG  [TPESD8004MUTAG]
U601  TPESD8004MUTAG  [TPESD8004MUTAG]
U602  TPESD8004MUTAG  [TPESD8004MUTAG]
U603  TPESD8004MUTAG  [TPESD8004MUTAG]
U604  TPESD8004MUTAG  [TPESD8004MUTAG]
U605  TPESD8004MUTAG  [TPESD8004MUTAG]
U606  TPESD8004MUTAG  [TPESD8004MUTAG]
U607  TPESD8004MUTAG  [TPESD8004MUTAG]

### Ports
BL (in, see 1[3C]), CTL (harness LCD_CTL, see 1[3C]), DAT (harness LCD_DAT, see 1[3C]), TCH (harness LCD_TCH, see 1[3C])

### Harnesses
LCD_DAT: R[0..7], G[0..7], B[0..7]
LCD_CTL: HSYNC, VSYNC, DE, CLK
LCD_TCH: SDA, SCL, INT, RST

### Nets
GND: D600.2 J600.4(GLED) J600.5(GLED) J600.36(GND) U600.3(GND) U600.8(GND) U601.3(GND) U601.8(GND) U602.3(GND) U602.8(GND) U603.3(GND) U603.8(GND) U604.3(GND) U604.8(GND) U605.3(GND) U605.8(GND) U606.3(GND) U606.8(GND) U607.3(GND) U607.8(GND)  [project net GDRVA]
VLCD: J600.6(VCC) J600.7(VCC)  [project net +3V3]
VLCD_BL: J600.1(VLED) J600.2(VLED)  [project net +5V]
B0: J600.12(B0) U601.1(IO1) U601.10(NC)
B1: J600.16(B1) U602.1(IO1) U602.10(NC)
B2: J600.19(B2) U602.5(IO4) U602.6(NC)
B3: J600.18(B3) U602.4(IO3) U602.7(NC)
B4: J600.17(B4) U602.2(IO2) U602.9(NC)
B5: J600.15(B5) U601.5(IO4) U601.6(NC)
B6: J600.14(B6) U601.4(IO3) U601.7(NC)
B7: J600.13(B7) U601.2(IO2) U601.9(NC)
BL: D600.1 J600.3(BL) ; port BL
CLK: J600.37(CLK) U607.1(IO1) U607.10(NC) ; port CTL.CLK
DE: J600.9(DE) U600.2(IO2) U600.9(NC) ; port CTL.DE
G0: J600.24(G0) U604.1(IO1) U604.10(NC)
G1: J600.20(G1) U603.1(IO1) U603.10(NC)
G2: J600.27(G2) U604.5(IO4) U604.6(NC)
G3: J600.26(G3) U604.4(IO3) U604.7(NC)
G4: J600.25(G4) U604.2(IO2) U604.9(NC)
G5: J600.23(G5) U603.5(IO4) U603.6(NC)
G6: J600.22(G6) U603.4(IO3) U603.7(NC)
G7: J600.21(G7) U603.2(IO2) U603.9(NC)
HSYNC: J600.11(HSYNC) U600.5(IO4) U600.6(NC) ; port CTL.HSYNC
LCD_INT: R600.2 ; port TCH.INT
LCD_SCL: R601.2 ; port TCH.SCL
LCD_SDA: R602.2 ; port TCH.SDA
R0: J600.28(R0) U605.1(IO1) U605.10(NC)  [project net LCD_R0]
R1: J600.32(R1) U606.1(IO1) U606.10(NC)  [project net LCD_R1]
R2: J600.35(R2) U606.5(IO4) U606.6(NC)  [project net LCD_R2]
R3: J600.34(R3) U606.4(IO3) U606.7(NC)  [project net LCD_R3]
R4: J600.33(R4) U606.2(IO2) U606.9(NC)  [project net LCD_R4]
R5: J600.31(R5) U605.5(IO4) U605.6(NC)  [project net LCD_R5]
R6: J600.30(R6) U605.4(IO3) U605.7(NC)  [project net LCD_R6]
R7: J600.29(R7) U605.2(IO2) U605.9(NC)  [project net LCD_R7]
T_INT: J600.38(T_INT) R600.1 U607.2(IO2) U607.9(NC)
T_RST: J600.8(T_RST) U600.1(IO1) U600.10(NC) ; port TCH.RST  [project net LCD_RST]
T_SCL: J600.39(T_SCL) R601.1 U607.4(IO3) U607.7(NC)
T_SDA: J600.40(T_SDA) R602.1 U607.5(IO4) U607.6(NC)
VSYNC: J600.10(VSYNC) U600.4(IO3) U600.7(NC) ; port CTL.VSYNC  [project net LCD_VSYNC]

### Buses and harness runs
bus B[0..7]
bus G[0..7]
bus R[0..7]

### Notes on the sheet
- matched length tolerance = 100mil
- DRAWN
- CHECKED
- DRAWNBY
- SHEETS
- SHEETS_NO

### Library data of the parts
D600 = PESD5V0H1BSF: TVS/ESD; Supplier 1: LCSC; Supplier Part Number 1: C477989
J600 = FPC-RGBLCD: Supplier 1: LCSC; Supplier Part Number 1: C262674
R600-R602 = R: precision: 1%
U600-U607 = TPESD8004MUTAG: TVS/ESD; Supplier 1: LCSC; Supplier Part Number 1: C2827679